# Altium project MPBoard_ext.PrjPcb
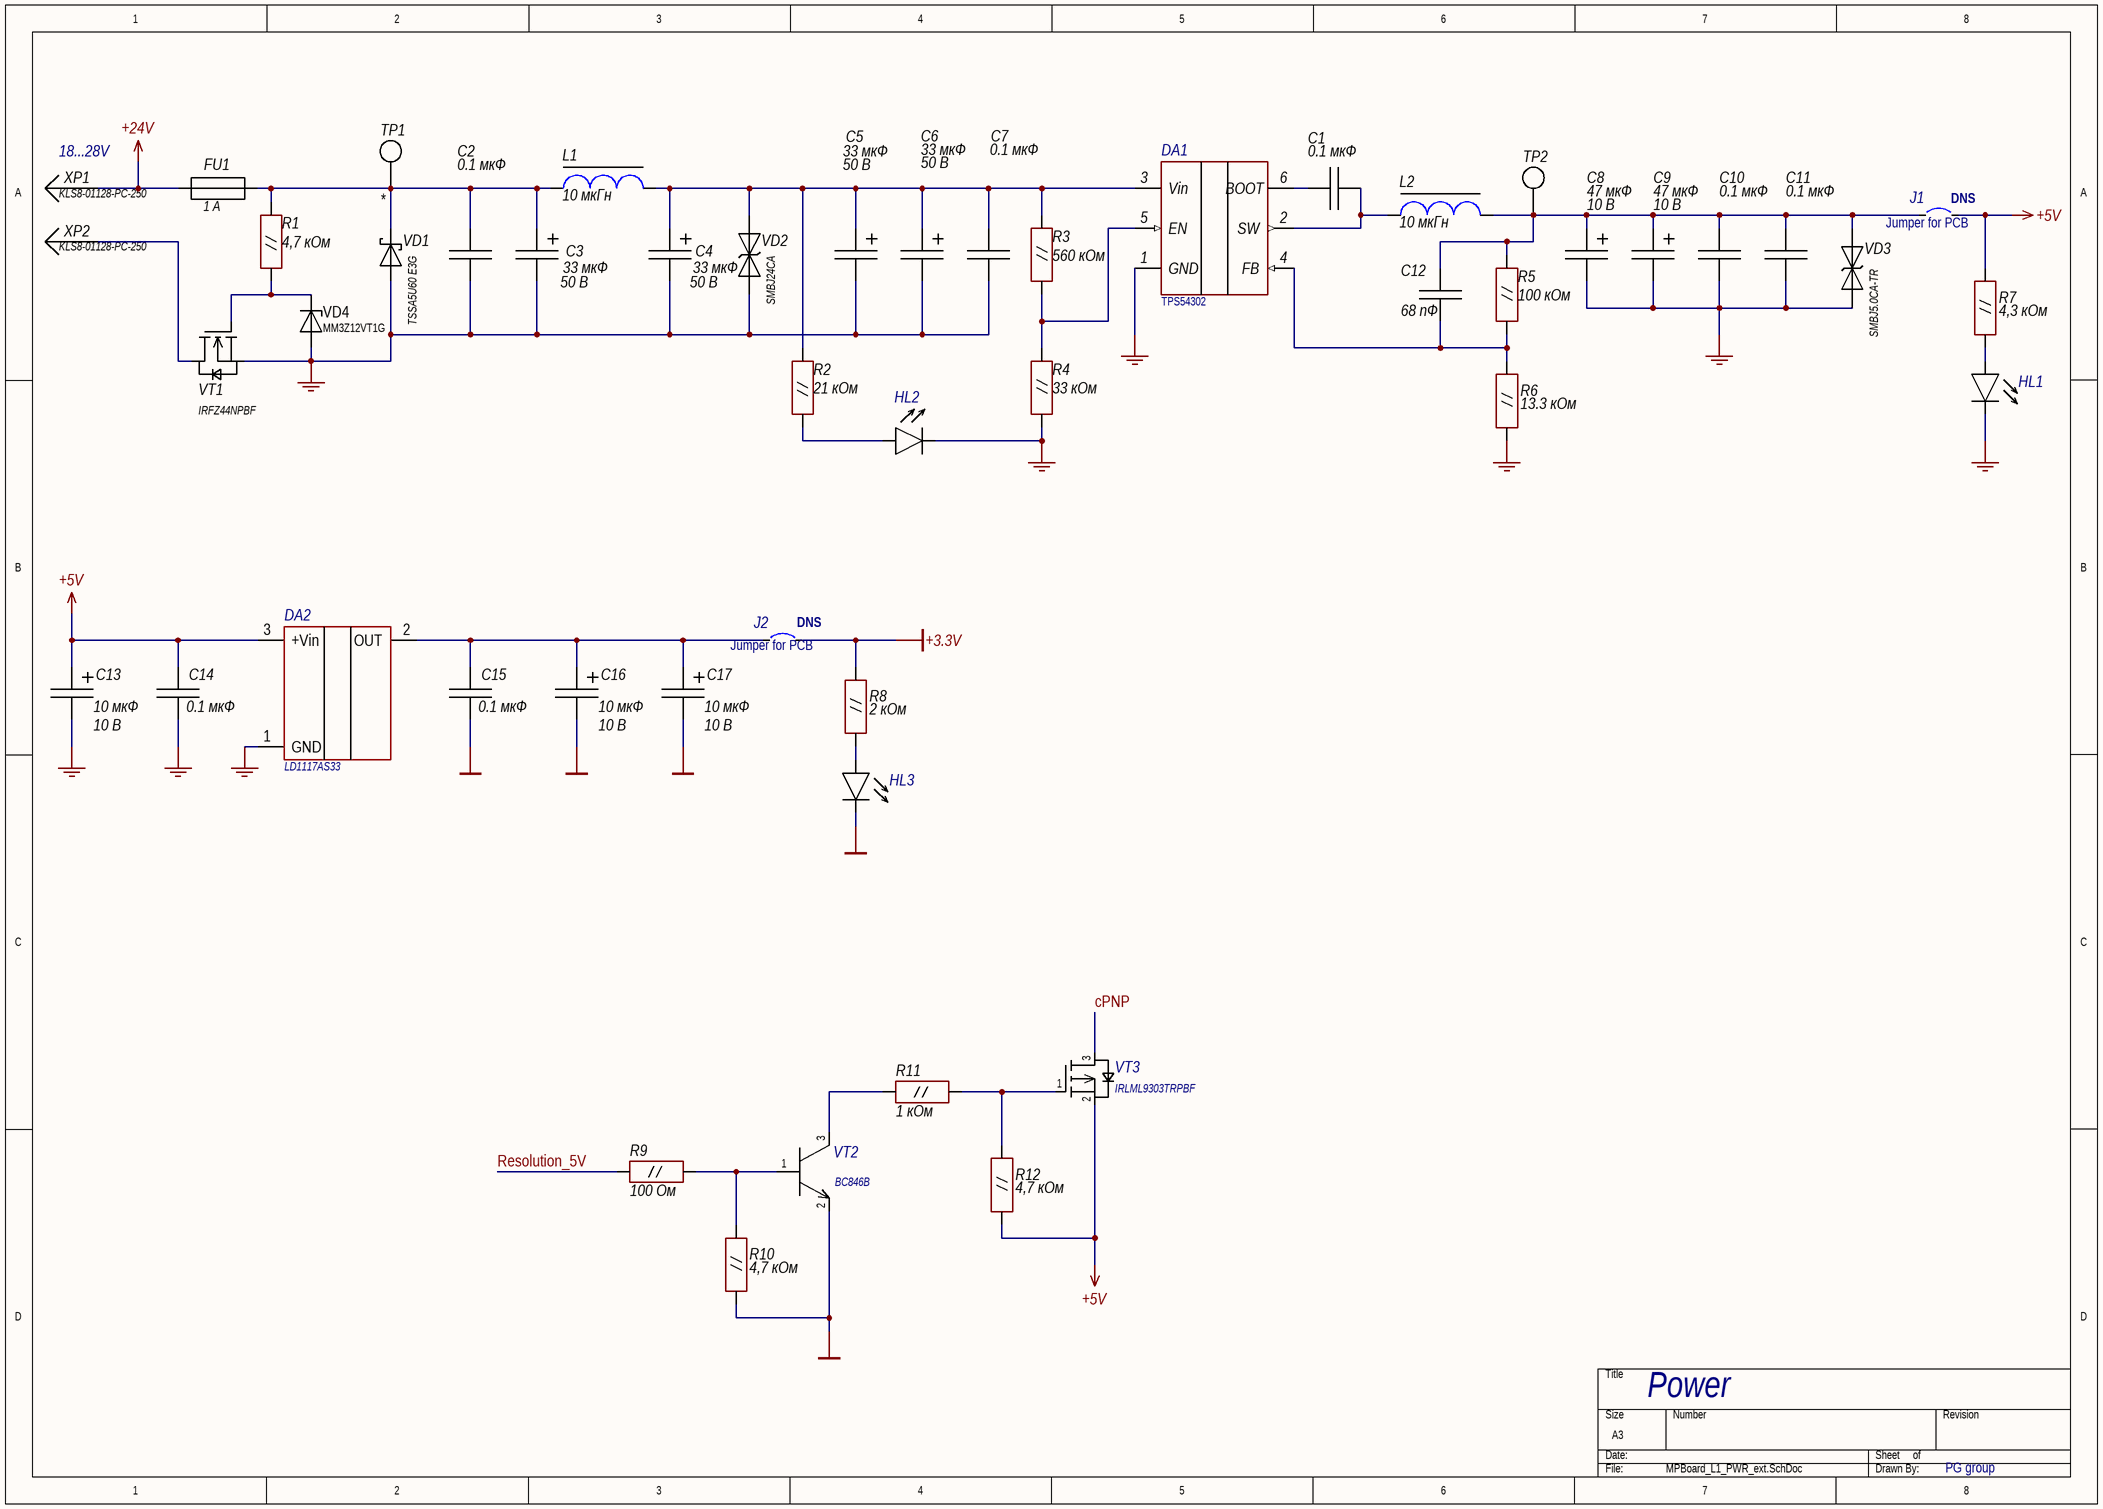
[diagram p0: MPBoard_L1_PWR_ext.SchDoc]
5 sheets, 340 parts. Net scope: global (net labels, ports and power ports of the same name join across sheets).
Board file: MPBoard_ext.PcbDoc
Sheets:
  MPBoard_L1_PWR_ext.SchDoc
  MPBoard_L2_Relay1_ext.SchDoc
  MPBoard_L3_Relay2_ext.SchDoc
  MPBoard_L4_Sens1_ext.SchDoc
  MPBoard_L5_Sens_2_ext.SchDoc

## Sheet MPBoard_L1_PWR_ext.SchDoc
size A3; SheetNumber: 1; SheetTotal: 5; SPICEModelCacheOIQWJWRF: <root> / <DocumentId>OIQWJWRF</DocumentId> / </root>

### Parts
C1  0.1 мкФ  [CAP-0805]
C2  0.1 мкФ  [CAP-0805]
C3  33 мкФ  Voltage: 50 В  [CAPAE-103]
C4  33 мкФ  Voltage: 50 В  [CAPAE-103]
C5  33 мкФ  Voltage: 50 В  [CAPAE-103]
C6  33 мкФ  Voltage: 50 В  [CAPAE-103]
C7  0.1 мкФ  [CAP-0805]
C8  47 мкФ  Voltage: 10 В  [CAPMP-3528]
C9  47 мкФ  Voltage: 10 В  [CAPMP-3528]
C10  0.1 мкФ  [CAP-0805]
C11  0.1 мкФ  [CAP-0805]
C12  68 пФ  [CAP-0805]
C13  10 мкФ  Voltage: 10 В  [CAPMP-3528]
C14  0.1 мкФ  [CAP-0805]
C15  0.1 мкФ  [CAP-0805]
C16  10 мкФ  Voltage: 10 В  [CAPMP-3528]
C17  10 мкФ  Voltage: 10 В  [CAPMP-3528]
DA1  TPS54302  [SOT23-6]
DA2  LD1117AS33  [SOT-223 LD1117]
FU1  1 A  [FUSE HOLDERS B 5X20]
HL1  Blue  [CH0805LB]  (value not drawn)
HL2  Red  [CH0805LR]  (value not drawn)
HL3  Green  [CH0805LG]  (value not drawn)
J1  Jumper for PCB  [JUMPER-SMD min]
J2  Jumper for PCB  [JUMPER-SMD min]
L1  10 мкГн  [IND_IHLP2525]
L2  10 мкГн  [IND_IHLP2525]
R1  4,7 кОм  [RES-0805]
R2  21 кОм  [RES-0805]
R3  560 кОм  [RES-0805]
R4  33 кОм  [RES-0805]
R5  100 кОм  [RES-0805]
R6  13.3 кОм  [RES-0805]
R7  4,3 кОм  [RES-0805]
R8  2 кОм  [RES-0805]
R9  100 Ом  [RES-0805]
R10  4,7 кОм  [RES-0805]
R11  1 кОм  [RES-0805]
R12  4,7 кОм  [RES-0805]
TP1  *  [TP_1.5]  (no BOM)
TP2  *  [TP_1.5]  (value not drawn)  (no BOM)
VD1  TSSA5U60 E3G  [DIODE SMA]
VD2  SMBJ24CA  [DIODE SMB]
VD3  SMBJ5.0CA-TR  [DIODE SMB]
VD4  MM3Z12VT1G  [SOD-323]
VT1  IRFZ44NPBF  [TO220S inline]
VT2  BC846B  [SOT23]
VT3  IRLML9303TRPBF  [SOT23]
XP1  KLS8-01128-PC-250  [PCB TAB 4]
XP2  KLS8-01128-PC-250  [PCB TAB 4]

### Nets
+3.3V: J2.2 R8.1
+5V: C13.1 C14.2 DA2.3(+Vin) J1.2 R7.1 R12.2 VT3.2(S)
+24V: FU1.1 XP1.1
GND: C2.2 C3.2 C4.2 C5.2 C6.2 C7.2 C8.2 C9.2 C10.2 C11.2 C13.2 C14.1 C15.1 C16.2 C17.2 DA1.1(GND) DA2.1(GND) HL1.2 HL2.2 HL3.2 R4.2 R6.2 R10.2 VD1.1 VD2.1 VD3.1 VD4.1 VT1.3(S) VT2.2(E)
cPNP: VT3.3(D)
Resolution_5V: R9.1
NetC1_1: C1.1 DA1.6(BOOT)
NetC1_2: C1.2 DA1.2(SW) L2.1
NetC2_1: C2.1 C3.1 FU1.2 L1.1 R1.2 TP1.1 VD1.2
NetC4_1: C4.1 C5.1 C6.1 C7.1 DA1.3(Vin) L1.2 R2.2 R3.1 VD2.2
NetC8_1: C8.1 C9.1 C10.1 C11.1 C12.1 J1.1 L2.2 R5.1 TP2.1 VD3.2
NetC12_2: C12.2 DA1.4(FB) R5.2 R6.1
NetC15_2: C15.2 C16.1 C17.1 DA2.2(OUT) J2.1
NetDA1_5: DA1.5(EN) R3.2 R4.1
NetHL1_1: HL1.1 R7.2
NetHL2_1: HL2.1 R2.1
NetHL3_1: HL3.1 R8.2
NetR1_1: R1.1 VD4.2 VT1.1(G)
NetR9_2: R9.2 R10.1 VT2.1(B)
NetR11_1: R11.1 VT2.3(C)
NetR11_2: R11.2 R12.1 VT3.1(G)
NetVT1_2: VT1.2(D) XP2.1

### Notes on the sheet
- (near XP1) 18...28V
- (near J1) DNS
- (near J2) DNS
- Power
- PG group

### Library data of the parts
C1 C2 C7 C10 = C: Конденсатор; MFPartNum: C0805C103K5RAC7025; IPSPartNumber: 65-724-19; Dielectric: X7R; MF: KEMET; Tolerance: ± 10 %; Voltage: 50 В; ValueDescription: Конденсатор 0.1 мкФ ± 10 % 50 В X7R SMD 0805; Package: SMD 0805; Value: 0.1 мкФ; HelpURL: https://content.kemet.com/datasheets/KEM_C1002_X7R_SMD.pdf; NameRUS: Конденсатор
C3 C4 = C_POLAR: Конденсатор полярный; MF: KEMET; Tolerance: ± 10 %; ValueDescription: Конденсатор 33 мкФ ± 10 % 50 В ECAP SMD; Package: ECAP SMD; Value: 33 мкФ; MFPartNum: *; HelpURL: *; IPSPartNumber: *; NameRUS: Конденсатор
C5 C6 = C_POLAR: Конденсатор полярный; IPSPartNumber: 2283588; MF: KEMET; Tolerance: ± 10 %; ValueDescription: Конденсатор 33 мкФ ± 10 % 50 В ECAP SMD; Package: ECAP SMD; Value: 33 мкФ; HelpURL: https://api.kemet.com/component-edge/download/datasheet/T491D336K035AT.pdf; NameRUS: Конденсатор
C8 C9 = C_POLAR: Конденсатор полярный / тантал; MFPartNum: T491B476K006AT; MF: KEMET; Tolerance: ± 10 %; ValueDescription: Конденсатор 47 мкФ ± 10 % 10 В Case B; Package: Case B; Value: 47 мкФ; HelpURL: https://content.kemet.com/datasheets/KEM_T2005_T491.pdf; IPSPartNumber: 300-47-868; NameRUS: Конденсатор
C11 = C: Конденсатор; MFPartNum: C0805C103K5RAC7025; IPSPartNumber: 65-765-65; Dielectric: X7R; MF: KEMET; Tolerance: ± 10 %; Voltage: 50 В; ValueDescription: Конденсатор 0.1 мкФ ± 10 % 50 В X7R SMD 0805; Package: SMD 0805; Value: 0.1 мкФ; HelpURL: https://content.kemet.com/datasheets/KEM_C1002_X7R_SMD.pdf; NameRUS: Конденсатор
C12 = C: Конденсатор; MFPartNum: C0805C680J5GACTU; Dielectric: C0G; MF: KEMET; Tolerance: ± 5 %; Voltage: 50 В; ValueDescription: Конденсатор 68 пФ ± 5 % 50 В C0G SMD 0805; Package: SMD 0805; Value: 68 пФ; IPSPartNumber: 165-72-398; NameRUS: Конденсатор
C13 C16 C17 = C_POLAR: Конденсатор полярный / тантал; MFPartNum: T491B476K006AT; MF: KEMET; Tolerance: ± 10 %; ValueDescription: Конденсатор 10 мкФ ± 10 % 10 В Case A; Package: Case A; Value: 10 мкФ; HelpURL: https://content.kemet.com/datasheets/KEM_T2005_T491.pdf; IPSPartNumber: 300-47-868; NameRUS: Конденсатор
C14 C15 = C: Конденсатор; MFPartNum: C0805C103K5RAC7025; MF: KEMET; Tolerance: ± 10 %; Voltage: 50 В; ValueDescription: Конденсатор 0.1 мкФ ± 10 % 50 В * SMD 0805; Dielectric: *; Package: SMD 0805; Value: 0.1 мкФ; HelpURL: *; IPSPartNumber: *; NameRUS: Конденсатор
DA1 = DA_TPS54302: DC/DC Buck; MFPartNum: TPS54302DDCR; MF: Texas Instruments; ValueDescription: Микросхема TPS54302 SOT23-6; NameRUS: Микросхема; Value: TPS54302; HelpURL: https://www.ti.com/lit/ds/symlink/tps54302.pdf?HQS=TI-null-null-digikeymode-df-pf-null-wwe&ts=1594294685289; Package: SOT23-6; IPSPartNumber: *
DA2 = DA_LD1117AS33: Linear Regulator 3.3V; MFPartNum: LD1117AS33TR; MF: STMicroelectronics; Package: SOT-223; HelpURL: https://eu.mouser.com/ProductDetail/STMicroelectronics/LD1117AS33TR?qs=C3bf%2FVrkE5CoDDd7wyn%252BaQ%3D%3D
FU1 = FU: Предохранитель; MFPartNum: RND 170-00190; Value: 1 A; MF: *; HelpURL: https://www.elfa.se/en/fuse-holder-clip-20-mm-3a-rnd-components-rnd-170-00190/p/30113404; IPSPartNumber: *; ValueDescription: =NameRUS+' '+Value+' '+ManufacturerPartNumber; NameRus: Предохранитель
HL1 = VD_LED: Светодиод; MFPartNum: FYLS-0805UBC; MF: Foryard; HelpURL: *; Value: Blue; Package: SMD 0805; IPSPartNumber: *; ValueDescription: =NameRUS+' '+ManufacturerPartNumber+' '+Package; NameRUS: Светодиод
HL2 = VD_LED: Светодиод; MFPartNum: FYLS-0805URC; MF: Foryard; HelpURL: *; Value: Red; Package: SMD 0805; IPSPartNumber: *; ValueDescription: =NameRUS+' '+ManufacturerPartNumber+' '+Package; NameRUS: Светодиод
HL3 = VD_LED: Светодиод; MFPartNum: FYLS-0805UGC; MF: Foryard; HelpURL: *; Value: Green; Package: SMD 0805; IPSPartNumber: *; ValueDescription: =NameRUS+' '+ManufacturerPartNumber+' '+Package; NameRUS: Светодиод
J1 J2 = Jumper: Перемычка на плату
L1 L2 = L_CORE: Индуктивность; MFPartNum: IHLP2525EZER100M01; MF: Vishay; AddDescription: 4.5А; Tolerance: ± 20 %; NameRUS: Дроссель; Value: 10 мкГн; HelpURL: https://www.vishay.com/docs/34177/ihlp-2525ez-01.pdf; IPSPartNumber: *; ValueDescription: =NameRUS+' '+Value+' '+Tolerance+' '+AddDescription+' '+Package
R1 R10 R12 = R_0.125W: Резистор 0.125 W; MFPartNum: CRCW080513K3FKEA; MF: Vishay; Tolerance: ± 1 %; ValueDescription: Резистор 4,7 кОм ± 1 % SMD 0805; Package: SMD 0805; Value: 4,7 кОм; HelpURL: https://www.vishay.com/docs/20035/dcrcwe3.pdf; IPSPartNumber: *; NameRUS: Резистор
R2 = R_0.125W: Резистор 0.125 W; MFPartNum: CRCW080513K3FKEA; MF: Vishay; Tolerance: ± 1 %; ValueDescription: Резистор 21 кОм ± 1 % SMD 0805; Package: SMD 0805; Value: 21 кОм; HelpURL: https://www.vishay.com/docs/20035/dcrcwe3.pdf; IPSPartNumber: *; NameRUS: Резистор
R3 = R_0.125W: Резистор 0.125 W; MFPartNum: CRCW080513K3FKEA; MF: Vishay; Tolerance: ± 5 %; ValueDescription: Резистор 560 кОм ± 5 % SMD 0805; Package: SMD 0805; Value: 560 кОм; HelpURL: https://www.vishay.com/docs/20035/dcrcwe3.pdf; IPSPartNumber: *; NameRUS: Резистор
R4 = R_0.125W: Резистор 0.125 W; MFPartNum: CRCW080513K3FKEA; MF: Vishay; Tolerance: ± 5 %; ValueDescription: Резистор 33 кОм ± 5 % SMD 0805; Package: SMD 0805; Value: 33 кОм; HelpURL: https://www.vishay.com/docs/20035/dcrcwe3.pdf; IPSPartNumber: *; NameRUS: Резистор
R5 = R_0.125W: Резистор 0.125 W; MFPartNum: CRCW080513K3FKEA; MF: Vishay; Tolerance: ± 5 %; ValueDescription: Резистор 100 кОм ± 5 % SMD 0805; Package: SMD 0805; Value: 100 кОм; HelpURL: https://www.vishay.com/docs/20035/dcrcwe3.pdf; IPSPartNumber: *; NameRUS: Резистор
R6 = R_0.125W: Резистор 0.125 W; MFPartNum: CRCW080513K3FKEA; MF: Vishay; Tolerance: ± 1 %; ValueDescription: Резистор 13.3 кОм ± 1 % SMD 0805; Package: SMD 0805; Value: 13.3 кОм; HelpURL: https://www.vishay.com/docs/20035/dcrcwe3.pdf; IPSPartNumber: *; NameRUS: Резистор
R7 = R_0.125W: Резистор 0.125 W; MFPartNum: CRCW080513K3FKEA; MF: Vishay; Tolerance: ± 1 %; ValueDescription: Резистор 4,3 кОм ± 1 % SMD 0805; Package: SMD 0805; Value: 4,3 кОм; HelpURL: https://www.vishay.com/docs/20035/dcrcwe3.pdf; IPSPartNumber: *; NameRUS: Резистор
R8 = R_0.125W: Резистор 0.125 W; MFPartNum: CRCW080513K3FKEA; MF: Vishay; Tolerance: ± 1 %; ValueDescription: Резистор 2 кОм ± 1 % SMD 0805; Package: SMD 0805; Value: 2 кОм; HelpURL: https://www.vishay.com/docs/20035/dcrcwe3.pdf; IPSPartNumber: *; NameRUS: Резистор
R9 = R_0.125W: Резистор 0.125 W; MFPartNum: CRCW080513K3FKEA; MF: Vishay; Tolerance: ± 1 %; ValueDescription: Резистор 100 Ом ± 1 % SMD 0805; Package: SMD 0805; Value: 100 Ом; HelpURL: https://www.vishay.com/docs/20035/dcrcwe3.pdf; IPSPartNumber: *; NameRUS: Резистор
R11 = R_0.125W: Резистор 0.125 W; MFPartNum: CRCW080513K3FKEA; MF: Vishay; Tolerance: ± 1 %; ValueDescription: Резистор 1 кОм ± 1 % SMD 0805; Package: SMD 0805; Value: 1 кОм; HelpURL: https://www.vishay.com/docs/20035/dcrcwe3.pdf; IPSPartNumber: *; NameRUS: Резистор
TP1 TP2 = TEST_POINT: Test Point; Name: *
VD1 = VD_SHOTTKY: Диод Шоттки; MF: Taiwan Semiconductor; Analogue: SS56; ValueDescription: Диод Шоттки TSSA5U60 E3G DO-214AC (SMA); MFPartNum: TSSA5U60 E3G; HelpURL: https://ru.mouser.com/datasheet/2/395/TSSA5U50%20SERIES_D1512-911402.pdf; Value: TSSA5U60 E3G; Package: DO-214AC (SMA); NameRUS: Диод Шоттки
VD2 = VD_TVS_BIDIR: Супрессор; MF: STMicroelectronics; ValueDescription: Супрессор SMBJ24CA DO-214AA (SMB); MFPartNum: SMBJ24CA; HelpURL: https://www.chipdip.by/product/smbj24ca-sunmate; Value: SMBJ24CA; Package: DO-214AA (SMB); IPSPartNumber: *; NameRUS: Супрессор
VD3 = VD_TVS_BIDIR: Супрессор; MF: STMicroelectronics; ValueDescription: Супрессор SMBJ5.0CA-TR DO-214AA (SMB); MFPartNum: SMBJ5.0CA-TR; HelpURL: https://www.chipdip.ru/product0/8001777571; Value: SMBJ5.0CA-TR; Package: DO-214AA (SMB); IPSPartNumber: 300-34-034; NameRUS: Супрессор
VD4 = VD_ZENER: Стабилитрон; MF: Nexperia; Analogue: BZX384-C12,115; ValueDescription: Стабилитрон MM3Z12VT1G SOD323; MFPartNum: MM3Z12VT1G; HelpURL: https://eu.mouser.com/datasheet/2/916/MM3Z_SER-2487701.pdf; Value: MM3Z12VT1G; Package: SOD323; NameRUS: Стабилитрон
VT1 = VT_N-MOSFET: MOSFET; MF: Infineon Technologies; NameRUS: N-канальный полевой транзистор; HelpURL: *; Value: IRFZ44N; IPSPartNumber: *; MFPartNum: IRFZ44NPBF; ValueDescription: =NameRUS+' '+ManufacturerPartNumber+' '+Voltage+' '+Current+' '+Package; Voltage: *; Current: *; Package: TO-220AB
VT2 = VT_NPN: NPN транзистор; MFPartNum: BC846B,215; MF: Nexperia B.V.; NameRUS: NPN биполярный транзистор; Voltage: 65 В; Current: 0.1; HelpURL: https://www.chipdip.by/product/bc846b; Value: BC846B; IPSPartNumber: *; ValueDescription: =NameRUS+' '+ManufacturerPartNumber+' '+Voltage+' '+Current+' '+Package; Package: SOT-23
VT3 = VT_P-MOSFET: P-MOSFET; MF: INFINEON TECHNOLOGIES AG.; Voltage: 30 В; Current: 2.3; MFPartNum: IRLML9303TRPBF; Package: SOT-23; HelpURL: https://www.chipdip.by/product/irlml9303trpbf
XP1 XP2 = XP1: Клемма папа; MF: KLS; MFPartNum: KLS8-01128-PC-250; HelpURL: https://www.chipdip.by/product/ta-m; Value: KLS8-01128-PC-250; Package: *

## Sheet MPBoard_L2_Relay1_ext.SchDoc
size A3; SheetNumber: 2; SheetTotal: 5
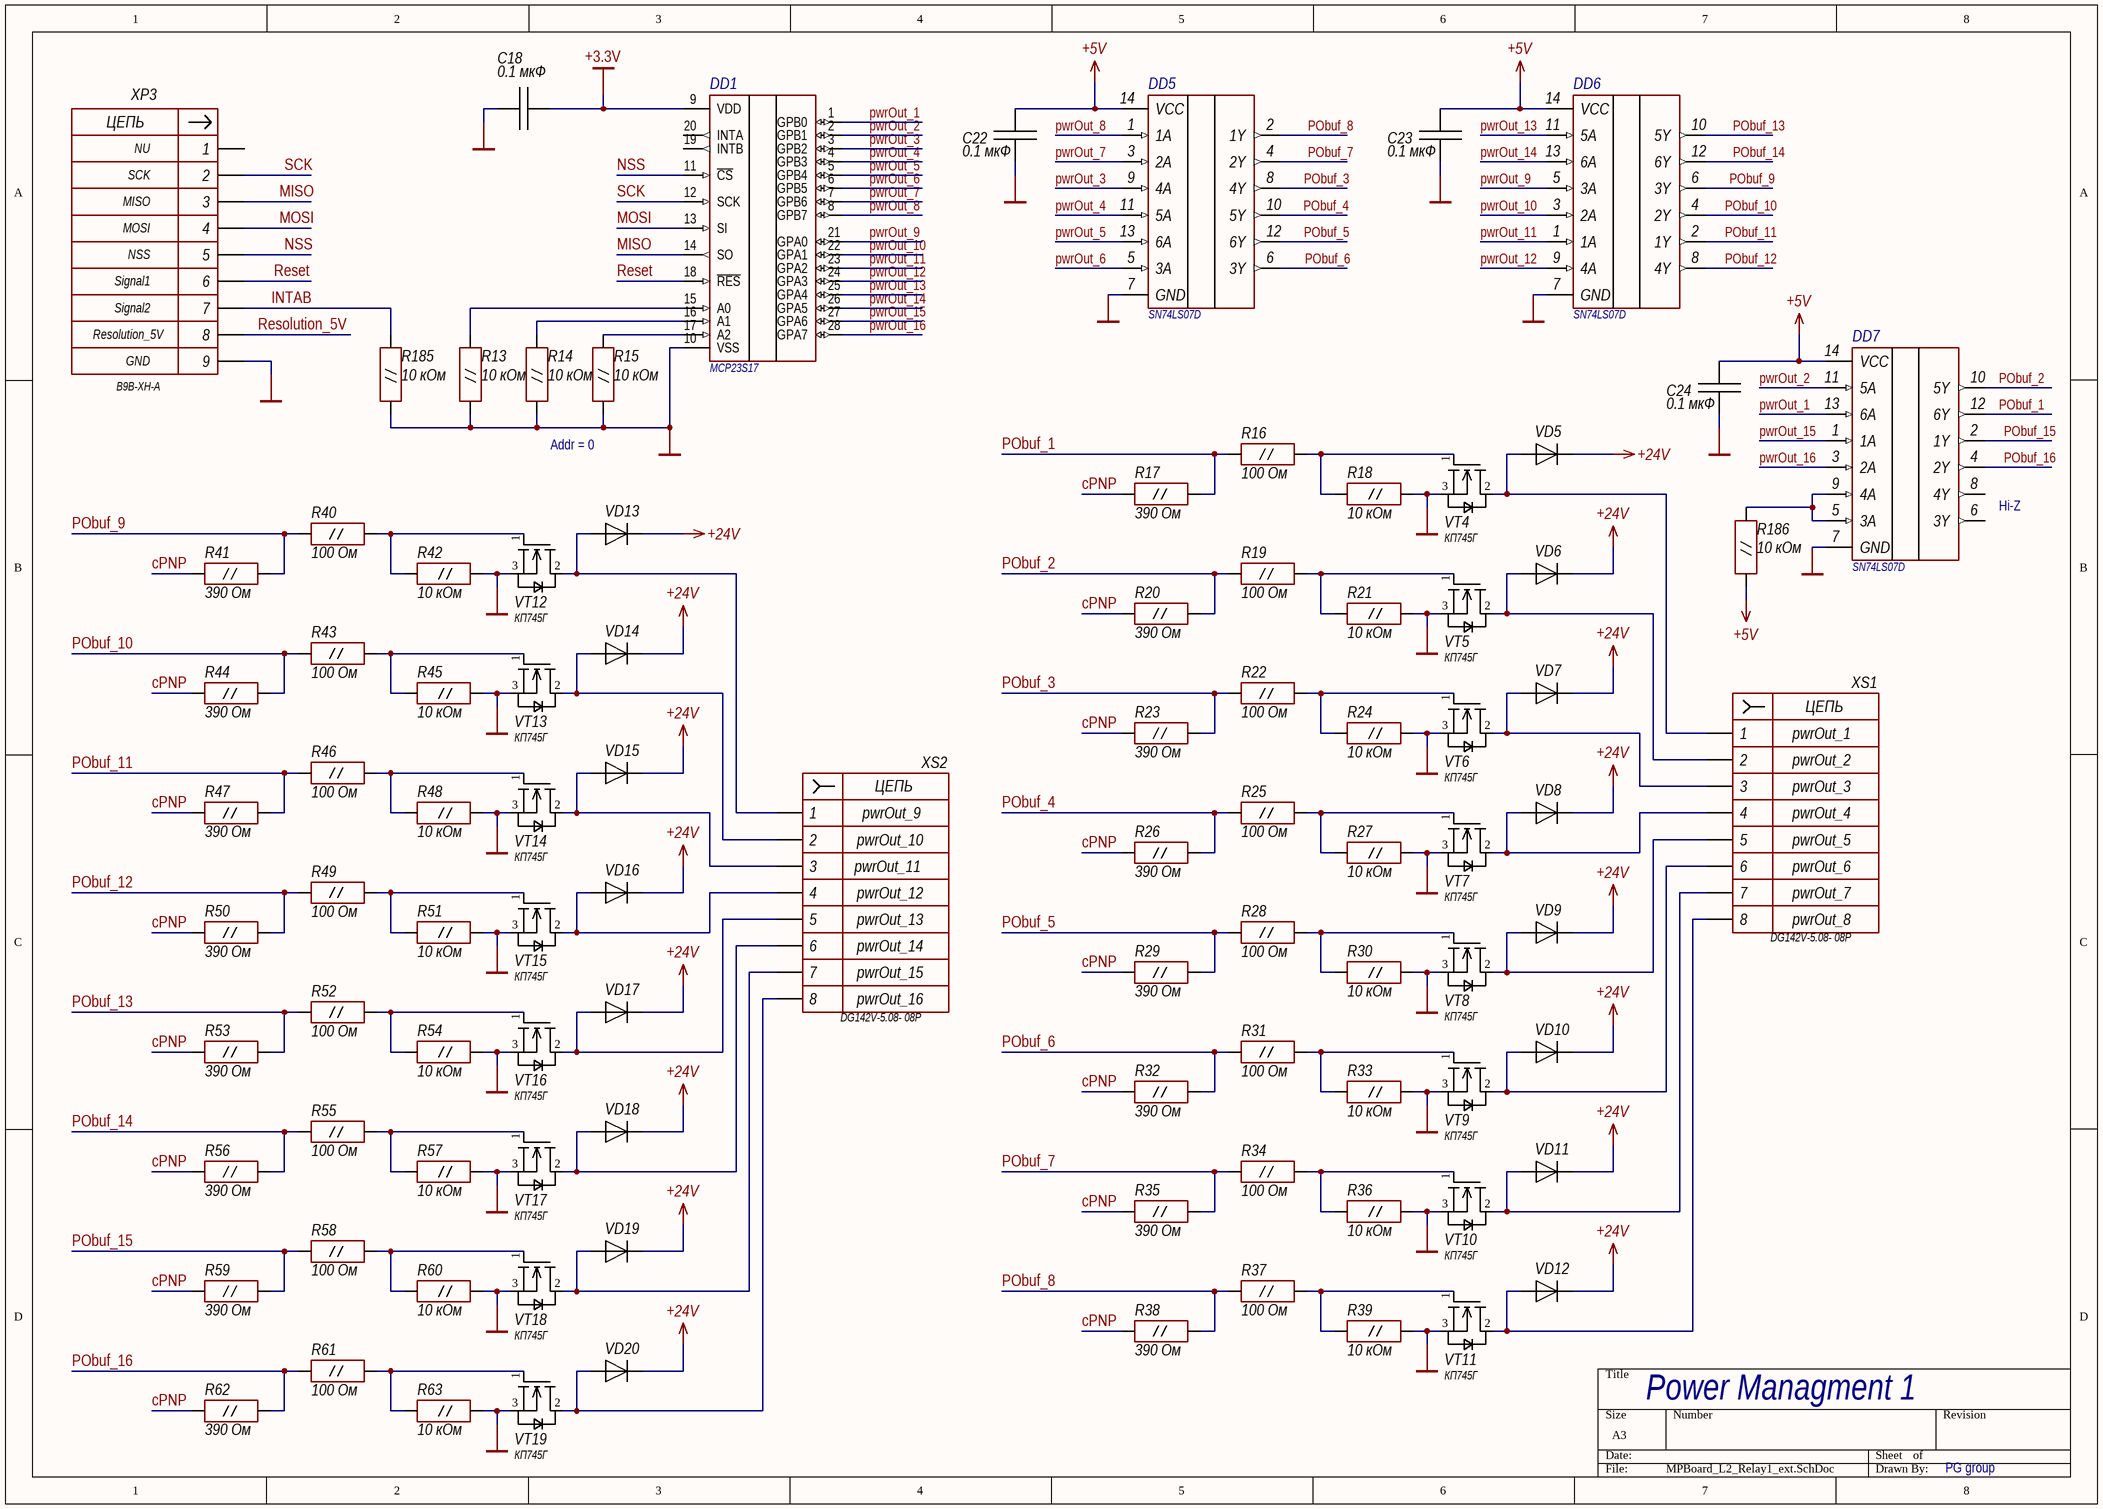
[diagram p1: MPBoard_L2_Relay1_ext.SchDoc]

### Parts
C18  0.1 мкФ  [CAP-0603]
C22  0.1 мкФ  [CAP-0603]
C23  0.1 мкФ  [CAP-0603]
C24  0.1 мкФ  [CAP-0603]
DD1  MCP23S17  [SOIC-28]
DD5  SN74LS07D  [SOIC-14]
DD6  SN74LS07D  [SOIC-14]
DD7  SN74LS07D  [SOIC-14]
R13  10 кОм  [RES-0603]
R14  10 кОм  [RES-0603]
R15  10 кОм  [RES-0603]
R16  100 Ом  [RES-0805]
R17  390 Ом  [RES-0805]
R18  10 кОм  [RES-0805]
R19  100 Ом  [RES-0805]
R20  390 Ом  [RES-0805]
R21  10 кОм  [RES-0805]
R22  100 Ом  [RES-0805]
R23  390 Ом  [RES-0805]
R24  10 кОм  [RES-0805]
R25  100 Ом  [RES-0805]
R26  390 Ом  [RES-0805]
R27  10 кОм  [RES-0805]
R28  100 Ом  [RES-0805]
R29  390 Ом  [RES-0805]
R30  10 кОм  [RES-0805]
R31  100 Ом  [RES-0805]
R32  390 Ом  [RES-0805]
R33  10 кОм  [RES-0805]
R34  100 Ом  [RES-0805]
R35  390 Ом  [RES-0805]
R36  10 кОм  [RES-0805]
R37  100 Ом  [RES-0805]
R38  390 Ом  [RES-0805]
R39  10 кОм  [RES-0805]
R40  100 Ом  [RES-0805]
R41  390 Ом  [RES-0805]
R42  10 кОм  [RES-0805]
R43  100 Ом  [RES-0805]
R44  390 Ом  [RES-0805]
R45  10 кОм  [RES-0805]
R46  100 Ом  [RES-0805]
R47  390 Ом  [RES-0805]
R48  10 кОм  [RES-0805]
R49  100 Ом  [RES-0805]
R50  390 Ом  [RES-0805]
R51  10 кОм  [RES-0805]
R52  100 Ом  [RES-0805]
R53  390 Ом  [RES-0805]
R54  10 кОм  [RES-0805]
R55  100 Ом  [RES-0805]
R56  390 Ом  [RES-0805]
R57  10 кОм  [RES-0805]
R58  100 Ом  [RES-0805]
R59  390 Ом  [RES-0805]
R60  10 кОм  [RES-0805]
R61  100 Ом  [RES-0805]
R62  390 Ом  [RES-0805]
R63  10 кОм  [RES-0805]
R185  10 кОм  [RES-0603]
R186  10 кОм  [RES-0603]
VD5  HER108  [DIOD-MILS-400]  (value not drawn)
VD6  HER108  [DIOD-MILS-400]  (value not drawn)
VD7  HER108  [DIOD-MILS-400]  (value not drawn)
VD8  HER108  [DIOD-MILS-400]  (value not drawn)
VD9  HER108  [DIOD-MILS-400]  (value not drawn)
VD10  HER108  [DIOD-MILS-400]  (value not drawn)
VD11  HER108  [DIOD-MILS-400]  (value not drawn)
VD12  HER108  [DIOD-MILS-400]  (value not drawn)
VD13  HER108  [DIOD-MILS-400]  (value not drawn)
VD14  HER108  [DIOD-MILS-400]  (value not drawn)
VD15  HER108  [DIOD-MILS-400]  (value not drawn)
VD16  HER108  [DIOD-MILS-400]  (value not drawn)
VD17  HER108  [DIOD-MILS-400]  (value not drawn)
VD18  HER108  [DIOD-MILS-400]  (value not drawn)
VD19  HER108  [DIOD-MILS-400]  (value not drawn)
VD20  HER108  [DIOD-MILS-400]  (value not drawn)
VT4  КП745Г  [TO220S inline]
VT5  КП745Г  [TO220S inline]
VT6  КП745Г  [TO220S inline]
VT7  КП745Г  [TO220S inline]
VT8  КП745Г  [TO220S inline]
VT9  КП745Г  [TO220S inline]
VT10  КП745Г  [TO220S inline]
VT11  КП745Г  [TO220S inline]
VT12  КП745Г  [TO220S inline]
VT13  КП745Г  [TO220S inline]
VT14  КП745Г  [TO220S inline]
VT15  КП745Г  [TO220S inline]
VT16  КП745Г  [TO220S inline]
VT17  КП745Г  [TO220S inline]
VT18  КП745Г  [TO220S inline]
VT19  КП745Г  [TO220S inline]
XP3  B9B-XH-A  NET9: GND  NET8: Resolution_5V  NET7: Signal2  NET6: Signal1  NET5: MOSI  NET1: NU  NET2: NSS  NET3: SCK  NET4: MISO  [JST-B9B-XH-A]
XS1  DG142V-5.08- 08P  NET6: pwrOut_6  NET5: pwrOut_5  NET1: pwrOut_1  NET2: pwrOut_2  NET3: pwrOut_3  NET4: pwrOut_4  NET7: pwrOut_7  NET8: pwrOut_8  [DG142V-5.08-08]
XS2  DG142V-5.08- 08P  NET6: pwrOut_14  NET5: pwrOut_13  NET1: pwrOut_9  NET2: pwrOut_10  NET3: pwrOut_11  NET4: pwrOut_12  NET7: pwrOut_15  NET8: pwrOut_16  [DG142V-5.08-08]

### Nets
+3.3V: C18.2 DD1.9(VDD)
+5V: C22.2 C23.2 C24.2 DD5.14(VCC) DD6.14(VCC) DD7.14(VCC) R186.1
+24V: VD5.2 VD6.2 VD7.2 VD8.2 VD9.2 VD10.2 VD11.2 VD12.2 VD13.2 VD14.2 VD15.2 VD16.2 VD17.2 VD18.2 VD19.2 VD20.2
GND: C18.1 C22.1 C23.1 C24.1 DD1.10(VSS) DD5.7(GND) DD6.7(GND) DD7.7(GND) R13.1 R14.1 R15.1 R18.1 R21.1 R24.1 R27.1 R30.1 R33.1 R36.1 R39.1 R42.1 R45.1 R48.1 R51.1 R54.1 R57.1 R60.1 R63.1 R185.1 VT4.3(S) VT5.3(S) VT6.3(S) VT7.3(S) VT8.3(S) VT9.3(S) VT10.3(S) VT11.3(S) VT12.3(S) VT13.3(S) VT14.3(S) VT15.3(S) VT16.3(S) VT17.3(S) VT18.3(S) VT19.3(S) XP3.9
cPNP: R17.1 R20.1 R23.1 R26.1 R29.1 R32.1 R35.1 R38.1 R41.1 R44.1 R47.1 R50.1 R53.1 R56.1 R59.1 R62.1
INTAB: R185.2 XP3.7
MISO: DD1.14(SO) XP3.3
MOSI: DD1.13(SI) XP3.4
NSS: DD1.11(~{CS}) XP3.5
PObuf_1: DD7.12(6Y) R16.1 R17.2
PObuf_2: DD7.10(5Y) R19.1 R20.2
PObuf_3: DD5.8(4Y) R22.1 R23.2
PObuf_4: DD5.10(5Y) R25.1 R26.2
PObuf_5: DD5.12(6Y) R28.1 R29.2
PObuf_6: DD5.6(3Y) R31.1 R32.2
PObuf_7: DD5.4(2Y) R34.1 R35.2
PObuf_8: DD5.2(1Y) R37.1 R38.2
PObuf_9: DD6.6(3Y) R40.1 R41.2
PObuf_10: DD6.4(2Y) R43.1 R44.2
PObuf_11: DD6.2(1Y) R46.1 R47.2
PObuf_12: DD6.8(4Y) R49.1 R50.2
PObuf_13: DD6.10(5Y) R52.1 R53.2
PObuf_14: DD6.12(6Y) R55.1 R56.2
PObuf_15: DD7.2(1Y) R58.1 R59.2
PObuf_16: DD7.4(2Y) R61.1 R62.2
pwrOut_1: DD1.1(GPB0) DD7.13(6A)
pwrOut_2: DD1.2(GPB1) DD7.11(5A)
pwrOut_3: DD1.3(GPB2) DD5.9(4A)
pwrOut_4: DD1.4(GPB3) DD5.11(5A)
pwrOut_5: DD1.5(GPB4) DD5.13(6A)
pwrOut_6: DD1.6(GPB5) DD5.5(3A)
pwrOut_7: DD1.7(GPB6) DD5.3(2A)
pwrOut_8: DD1.8(GPB7) DD5.1(1A)
pwrOut_9: DD1.21(GPA0) DD6.5(3A)
pwrOut_10: DD1.22(GPA1) DD6.3(2A)
pwrOut_11: DD1.23(GPA2) DD6.1(1A)
pwrOut_12: DD1.24(GPA3) DD6.9(4A)
pwrOut_13: DD1.25(GPA4) DD6.11(5A)
pwrOut_14: DD1.26(GPA5) DD6.13(6A)
pwrOut_15: DD1.27(GPA6) DD7.1(1A)
pwrOut_16: DD1.28(GPA7) DD7.3(2A)
Reset: DD1.18(~{RES}) XP3.6
Resolution_5V: XP3.8
SCK: DD1.12(SCK) XP3.2
NetDD1_15: DD1.15(A0) R13.2
NetDD1_16: DD1.16(A1) R14.2
NetDD1_17: DD1.17(A2) R15.2
NetDD7_5: DD7.5(3A) DD7.9(4A) R186.2
NetR16_2: R16.2 R18.2 VT4.1(G)
NetR19_2: R19.2 R21.2 VT5.1(G)
NetR22_2: R22.2 R24.2 VT6.1(G)
NetR25_2: R25.2 R27.2 VT7.1(G)
NetR28_2: R28.2 R30.2 VT8.1(G)
NetR31_2: R31.2 R33.2 VT9.1(G)
NetR34_2: R34.2 R36.2 VT10.1(G)
NetR37_2: R37.2 R39.2 VT11.1(G)
NetR40_2: R40.2 R42.2 VT12.1(G)
NetR43_2: R43.2 R45.2 VT13.1(G)
NetR46_2: R46.2 R48.2 VT14.1(G)
NetR49_2: R49.2 R51.2 VT15.1(G)
NetR52_2: R52.2 R54.2 VT16.1(G)
NetR55_2: R55.2 R57.2 VT17.1(G)
NetR58_2: R58.2 R60.2 VT18.1(G)
NetR61_2: R61.2 R63.2 VT19.1(G)
NetVD5_1: VD5.1 VT4.2(D) XS1.1
NetVD6_1: VD6.1 VT5.2(D) XS1.2
NetVD7_1: VD7.1 VT6.2(D) XS1.3
NetVD8_1: VD8.1 VT7.2(D) XS1.4
NetVD9_1: VD9.1 VT8.2(D) XS1.5
NetVD10_1: VD10.1 VT9.2(D) XS1.6
NetVD11_1: VD11.1 VT10.2(D) XS1.7
NetVD12_1: VD12.1 VT11.2(D) XS1.8
NetVD13_1: VD13.1 VT12.2(D) XS2.1
NetVD14_1: VD14.1 VT13.2(D) XS2.2
NetVD15_1: VD15.1 VT14.2(D) XS2.3
NetVD16_1: VD16.1 VT15.2(D) XS2.4
NetVD17_1: VD17.1 VT16.2(D) XS2.5
NetVD18_1: VD18.1 VT17.2(D) XS2.6
NetVD19_1: VD19.1 VT18.2(D) XS2.7
NetVD20_1: VD20.1 VT19.2(D) XS2.8

Not connected (* = marked no-connect by the designer): DD1 19(INTB) 20(INTA); DD7 6(3Y) 8(4Y); XP3 1

### Notes on the sheet
- Addr = 0
- (near DD7) Hi-Z
- Power Managment 1
- PG group
- (in symbol XP9) ЦЕПЬ
- (in symbol XS8) ЦЕПЬ

### Library data of the parts
C18 C22-C24 = C: Конденсатор; MFPartNum: C0603C101K5GAC; IPSPartNumber: 65-724-19; Dielectric: X7R; MF: KEMET; Tolerance: ± 10 %; Voltage: 50 В; ValueDescription: Конденсатор 0.1 мкФ ± 10 % 50 В X7R SMD 0603; Package: SMD 0603; Value: 0.1 мкФ; HelpURL: https://content.kemet.com/datasheets/KEM_C1002_X7R_SMD.pdf; NameRUS: Конденсатор
DD1 = DD_MCP23S17: I/O Expander 16 SPI; MF: Microchip; MFPartNum: MCP23S17; Package: SOIC-28; HelpURL: https://www.chipdip.ru/product/mcp23s17-e-so
DD5-DD7 = DD_SN74LS07D: 6-ch, 4.75_5.25V bipolar buffers with OC outputs; MF: Texas Instruments; MFPartNum: SN74LS07D; Package: SOIC-14; HelpURL: https://www.chipdip.by/product/sn74ls07d
R13-R15 R185 R186 = R_0.125W: Резистор 0.1 W; MFPartNum: D11/CRCW0603; MF: Vishay; Tolerance: ± 1 %; ValueDescription: Резистор 10 кОм ± 1 % SMD 0603; Package: SMD 0603; Value: 10 кОм; HelpURL: https://www.vishay.com/docs/20035/dcrcwe3.pdf; IPSPartNumber: *; NameRUS: Резистор
R16 R19 R22 R25 R28 R31 R34 R37 R40 R43 R46 R49 R52 R55 R58 R61 = R_0.125W: as R9 on sheet MPBoard_L1_PWR_ext; Package: SMD 0805; Value: 100 Ом; HelpURL: https://www.vishay.com/docs/20035/dcrcwe3.pdf; IPSPartNumber: *; NameRUS: Резистор
R17 R20 R23 R26 R29 R32 R35 R38 R41 R44 R47 R50 R53 R56 R59 R62 = R_0.125W: Резистор 0.125 W; MFPartNum: CRCW080513K3FKEA; MF: Vishay; Tolerance: ± 1 %; ValueDescription: Резистор 390 Ом ± 1 % SMD 0805; Package: SMD 0805; Value: 390 Ом; HelpURL: https://www.vishay.com/docs/20035/dcrcwe3.pdf; IPSPartNumber: *; NameRUS: Резистор
R18 R21 R24 R27 R30 R33 R36 R39 R42 R45 R48 R51 R54 R57 R60 R63 = R_0.125W: Резистор 0.125 W; MFPartNum: CRCW080513K3FKEA; MF: Vishay; Tolerance: ± 1 %; ValueDescription: Резистор 10 кОм ± 1 % SMD 0805; Package: SMD 0805; Value: 10 кОм; HelpURL: https://www.vishay.com/docs/20035/dcrcwe3.pdf; IPSPartNumber: *; NameRUS: Резистор
VD5-VD20 = VD: Диод Выпрямительный; MFPartNum: HER108G; MF: Taiwan Semiconductor; ValueDescription: Диод выпрямительный HER108 DO-204AL-2; HelpURL: https://eu.mouser.com/ProductDetail/?qs=tHU%2FlV7kTySN6KO41tibrA%3D%3D; Value: HER108; Package: DO-204AL-2; NameRUS: Диод выпрямительный
VT4-VT19 = VT_N-MOSFET: MOSFET; MF: Интеграл; Voltage: 100 В; Current: 15 А; Analogue: IRL530N; MFPartNum: КП745Г; Package: TO-220; HelpURL: https://belchip.by/product/?selected_product=10167
XP3 = XP9: вилка 9 контактов; MF: JST Corporation; Analogue: CWF-9; WK-09; DS1069-9MVW6; CWF-9 W7600-09PSNTW0R; ValueDescription: Разъем вилка B9B-XH-A; NameRUS: Разъем вилка; MFPartNum: B9B-XH-A; HelpURL: https://www.chipdip.ru/product0/8007237297?from=suggest_product; Value: B9B-XH-A
XS1 XS2 = XS8: розетка 8 контактов; MFPartNum: DG142V-5.08- 08P-14-00A(H); MF: Degson Electronics; ValueDescription: Разъем розетка DG142V-5.08- 08P; NameRUS: Разъем розетка; Value: DG142V-5.08- 08P; HelpURL: https://www.chipdip.by/product0/8077186472; IPSPartNumber: *

## Sheet MPBoard_L3_Relay2_ext.SchDoc
size A3; SheetNumber: 3; SheetTotal: 5
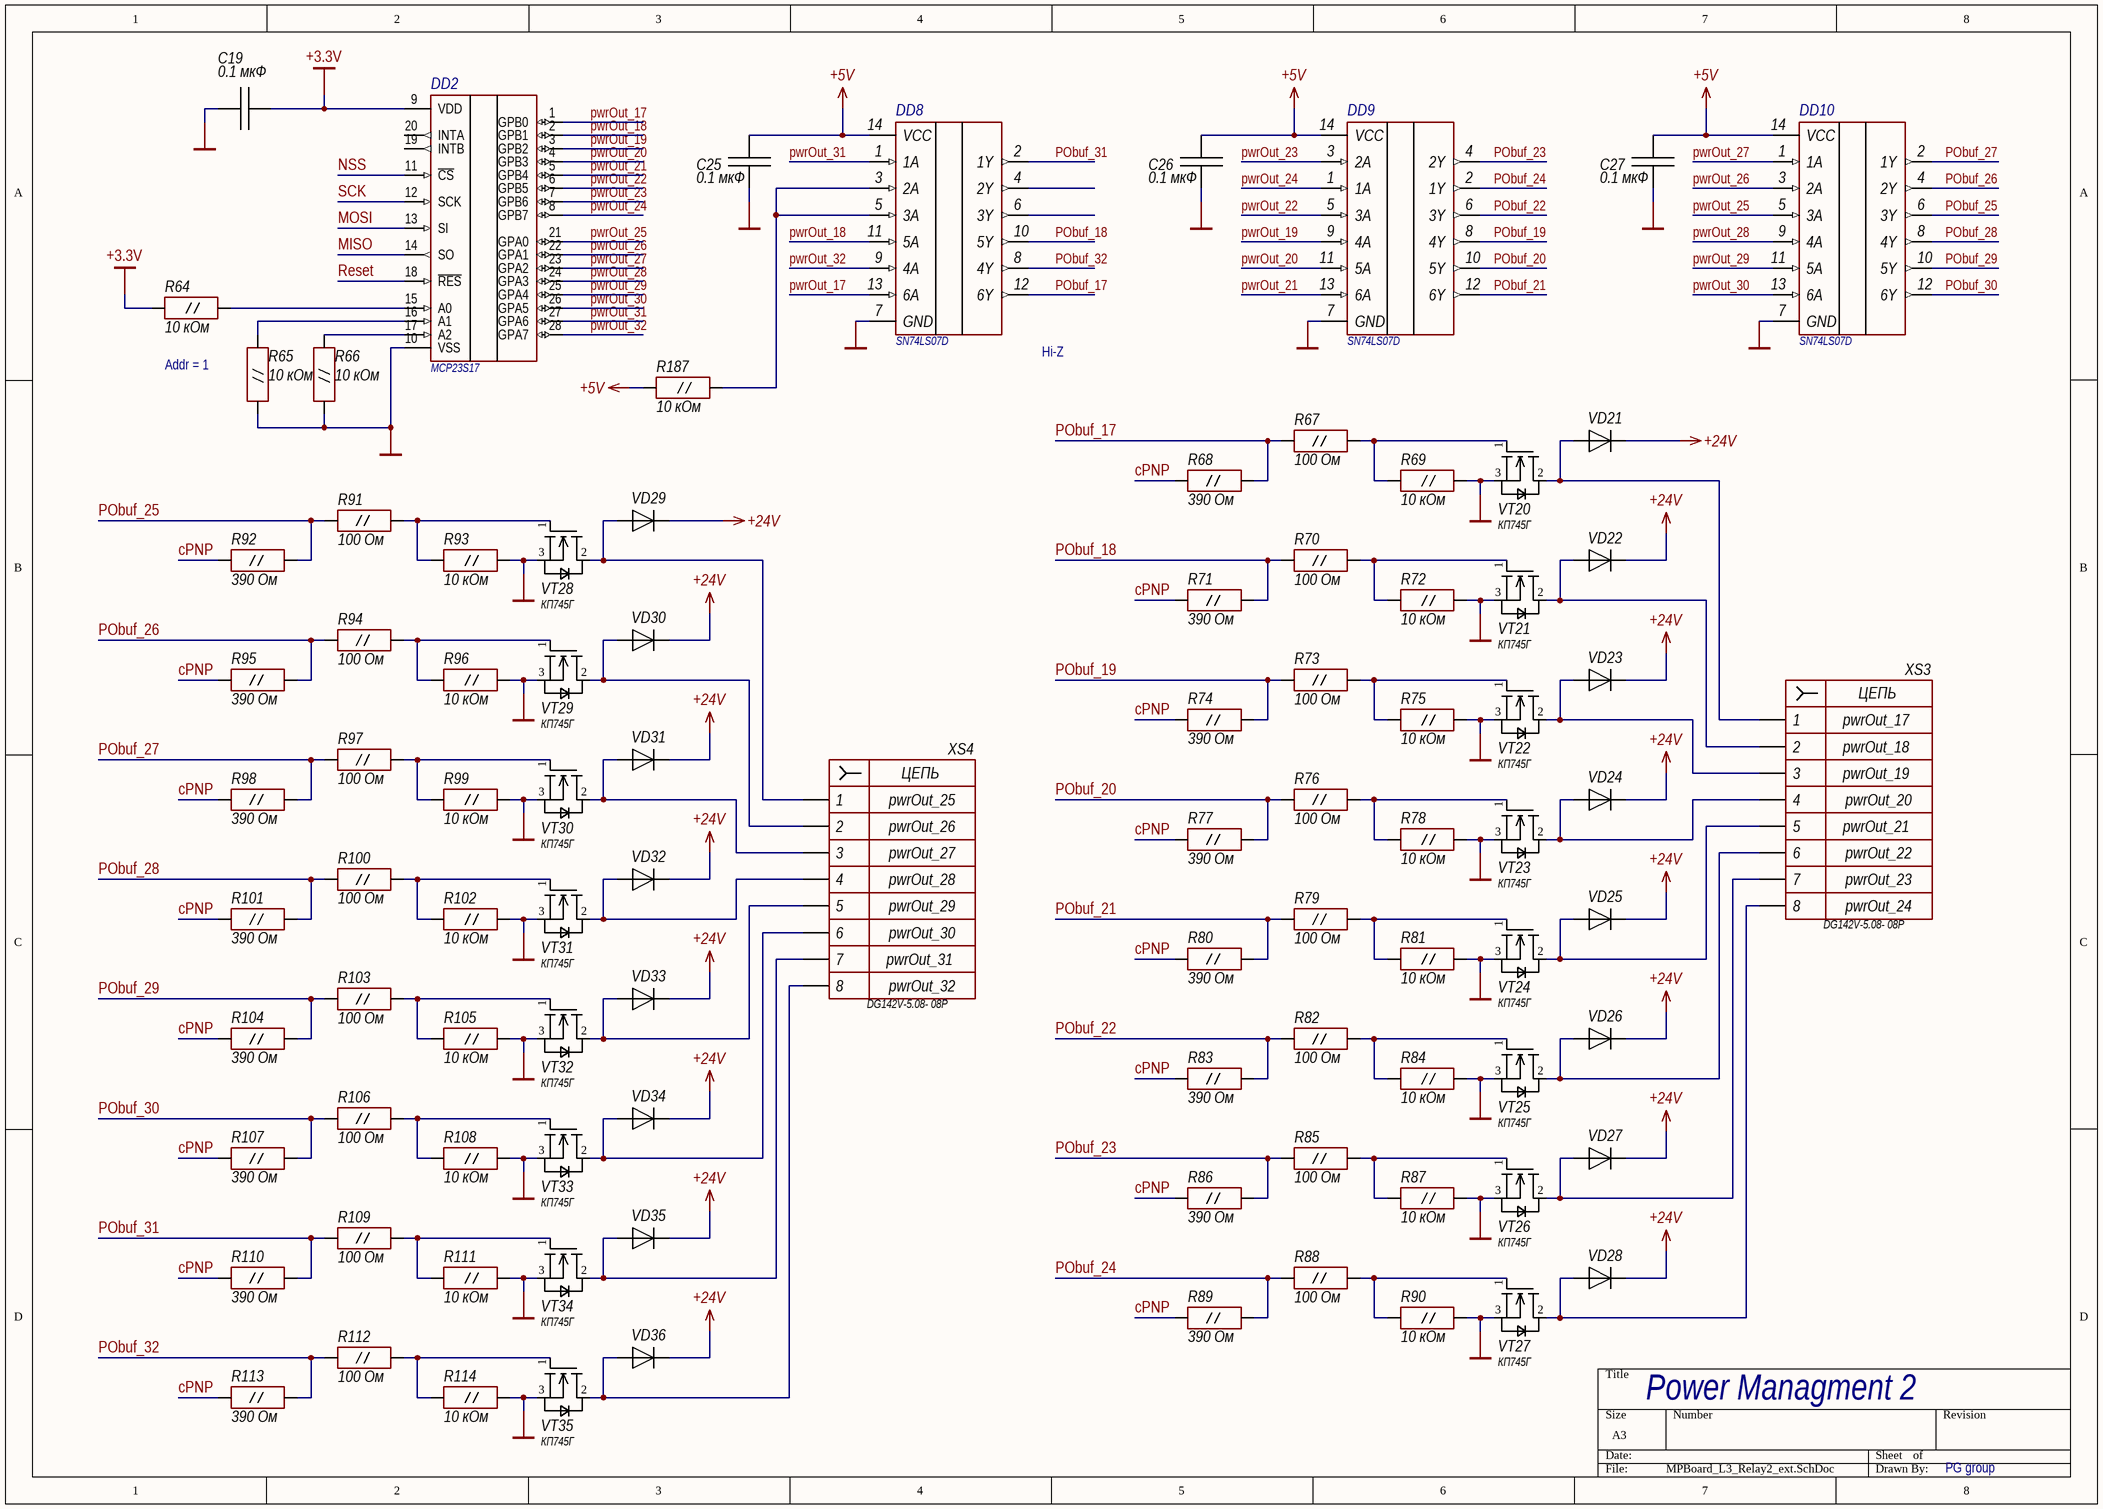
[diagram p2: MPBoard_L3_Relay2_ext.SchDoc]

### Parts
C19  0.1 мкФ  [CAP-0603]
C25  0.1 мкФ  [CAP-0603]
C26  0.1 мкФ  [CAP-0603]
C27  0.1 мкФ  [CAP-0603]
DD2  MCP23S17  [SOIC-28]
DD8  SN74LS07D  [SOIC-14]
DD9  SN74LS07D  [SOIC-14]
DD10  SN74LS07D  [SOIC-14]
R64  10 кОм  [RES-0603]
R65  10 кОм  [RES-0603]
R66  10 кОм  [RES-0603]
R67  100 Ом  [RES-0805]
R68  390 Ом  [RES-0805]
R69  10 кОм  [RES-0805]
R70  100 Ом  [RES-0805]
R71  390 Ом  [RES-0805]
R72  10 кОм  [RES-0805]
R73  100 Ом  [RES-0805]
R74  390 Ом  [RES-0805]
R75  10 кОм  [RES-0805]
R76  100 Ом  [RES-0805]
R77  390 Ом  [RES-0805]
R78  10 кОм  [RES-0805]
R79  100 Ом  [RES-0805]
R80  390 Ом  [RES-0805]
R81  10 кОм  [RES-0805]
R82  100 Ом  [RES-0805]
R83  390 Ом  [RES-0805]
R84  10 кОм  [RES-0805]
R85  100 Ом  [RES-0805]
R86  390 Ом  [RES-0805]
R87  10 кОм  [RES-0805]
R88  100 Ом  [RES-0805]
R89  390 Ом  [RES-0805]
R90  10 кОм  [RES-0805]
R91  100 Ом  [RES-0805]
R92  390 Ом  [RES-0805]
R93  10 кОм  [RES-0805]
R94  100 Ом  [RES-0805]
R95  390 Ом  [RES-0805]
R96  10 кОм  [RES-0805]
R97  100 Ом  [RES-0805]
R98  390 Ом  [RES-0805]
R99  10 кОм  [RES-0805]
R100  100 Ом  [RES-0805]
R101  390 Ом  [RES-0805]
R102  10 кОм  [RES-0805]
R103  100 Ом  [RES-0805]
R104  390 Ом  [RES-0805]
R105  10 кОм  [RES-0805]
R106  100 Ом  [RES-0805]
R107  390 Ом  [RES-0805]
R108  10 кОм  [RES-0805]
R109  100 Ом  [RES-0805]
R110  390 Ом  [RES-0805]
R111  10 кОм  [RES-0805]
R112  100 Ом  [RES-0805]
R113  390 Ом  [RES-0805]
R114  10 кОм  [RES-0805]
R187  10 кОм  [RES-0603]
VD21  HER108  [DIOD-MILS-400]  (value not drawn)
VD22  HER108  [DIOD-MILS-400]  (value not drawn)
VD23  HER108  [DIOD-MILS-400]  (value not drawn)
VD24  HER108  [DIOD-MILS-400]  (value not drawn)
VD25  HER108  [DIOD-MILS-400]  (value not drawn)
VD26  HER108  [DIOD-MILS-400]  (value not drawn)
VD27  HER108  [DIOD-MILS-400]  (value not drawn)
VD28  HER108  [DIOD-MILS-400]  (value not drawn)
VD29  HER108  [DIOD-MILS-400]  (value not drawn)
VD30  HER108  [DIOD-MILS-400]  (value not drawn)
VD31  HER108  [DIOD-MILS-400]  (value not drawn)
VD32  HER108  [DIOD-MILS-400]  (value not drawn)
VD33  HER108  [DIOD-MILS-400]  (value not drawn)
VD34  HER108  [DIOD-MILS-400]  (value not drawn)
VD35  HER108  [DIOD-MILS-400]  (value not drawn)
VD36  HER108  [DIOD-MILS-400]  (value not drawn)
VT20  КП745Г  [TO220S inline]
VT21  КП745Г  [TO220S inline]
VT22  КП745Г  [TO220S inline]
VT23  КП745Г  [TO220S inline]
VT24  КП745Г  [TO220S inline]
VT25  КП745Г  [TO220S inline]
VT26  КП745Г  [TO220S inline]
VT27  КП745Г  [TO220S inline]
VT28  КП745Г  [TO220S inline]
VT29  КП745Г  [TO220S inline]
VT30  КП745Г  [TO220S inline]
VT31  КП745Г  [TO220S inline]
VT32  КП745Г  [TO220S inline]
VT33  КП745Г  [TO220S inline]
VT34  КП745Г  [TO220S inline]
VT35  КП745Г  [TO220S inline]
XS3  DG142V-5.08- 08P  NET6: pwrOut_22  NET5: pwrOut_21  NET1: pwrOut_17  NET2: pwrOut_18  NET3: pwrOut_19  NET4: pwrOut_20  NET7: pwrOut_23  NET8: pwrOut_24  [DG142V-5.08-08]
XS4  DG142V-5.08- 08P  NET6: pwrOut_30  NET5: pwrOut_29  NET1: pwrOut_25  NET2: pwrOut_26  NET3: pwrOut_27  NET4: pwrOut_28  NET7: pwrOut_31  NET8: pwrOut_32  [DG142V-5.08-08]

### Nets
+3.3V: C19.2 DD2.9(VDD) R64.2
+5V: C25.2 C26.2 C27.2 DD8.14(VCC) DD9.14(VCC) DD10.14(VCC) R187.2
+24V: VD21.2 VD22.2 VD23.2 VD24.2 VD25.2 VD26.2 VD27.2 VD28.2 VD29.2 VD30.2 VD31.2 VD32.2 VD33.2 VD34.2 VD35.2 VD36.2
GND: C19.1 C25.1 C26.1 C27.1 DD2.10(VSS) DD8.7(GND) DD9.7(GND) DD10.7(GND) R65.1 R66.1 R69.1 R72.1 R75.1 R78.1 R81.1 R84.1 R87.1 R90.1 R93.1 R96.1 R99.1 R102.1 R105.1 R108.1 R111.1 R114.1 VT20.3(S) VT21.3(S) VT22.3(S) VT23.3(S) VT24.3(S) VT25.3(S) VT26.3(S) VT27.3(S) VT28.3(S) VT29.3(S) VT30.3(S) VT31.3(S) VT32.3(S) VT33.3(S) VT34.3(S) VT35.3(S)
cPNP: R68.1 R71.1 R74.1 R77.1 R80.1 R83.1 R86.1 R89.1 R92.1 R95.1 R98.1 R101.1 R104.1 R107.1 R110.1 R113.1
MISO: DD2.14(SO)
MOSI: DD2.13(SI)
NSS: DD2.11(~{CS})
PObuf_17: DD8.12(6Y) R67.1 R68.2
PObuf_18: DD8.10(5Y) R70.1 R71.2
PObuf_19: DD9.8(4Y) R73.1 R74.2
PObuf_20: DD9.10(5Y) R76.1 R77.2
PObuf_21: DD9.12(6Y) R79.1 R80.2
PObuf_22: DD9.6(3Y) R82.1 R83.2
PObuf_23: DD9.4(2Y) R85.1 R86.2
PObuf_24: DD9.2(1Y) R88.1 R89.2
PObuf_25: DD10.6(3Y) R91.1 R92.2
PObuf_26: DD10.4(2Y) R94.1 R95.2
PObuf_27: DD10.2(1Y) R97.1 R98.2
PObuf_28: DD10.8(4Y) R100.1 R101.2
PObuf_29: DD10.10(5Y) R103.1 R104.2
PObuf_30: DD10.12(6Y) R106.1 R107.2
PObuf_31: DD8.2(1Y) R109.1 R110.2
PObuf_32: DD8.8(4Y) R112.1 R113.2
pwrOut_17: DD2.1(GPB0) DD8.13(6A)
pwrOut_18: DD2.2(GPB1) DD8.11(5A)
pwrOut_19: DD2.3(GPB2) DD9.9(4A)
pwrOut_20: DD2.4(GPB3) DD9.11(5A)
pwrOut_21: DD2.5(GPB4) DD9.13(6A)
pwrOut_22: DD2.6(GPB5) DD9.5(3A)
pwrOut_23: DD2.7(GPB6) DD9.3(2A)
pwrOut_24: DD2.8(GPB7) DD9.1(1A)
pwrOut_25: DD2.21(GPA0) DD10.5(3A)
pwrOut_26: DD2.22(GPA1) DD10.3(2A)
pwrOut_27: DD2.23(GPA2) DD10.1(1A)
pwrOut_28: DD2.24(GPA3) DD10.9(4A)
pwrOut_29: DD2.25(GPA4) DD10.11(5A)
pwrOut_30: DD2.26(GPA5) DD10.13(6A)
pwrOut_31: DD2.27(GPA6) DD8.1(1A)
pwrOut_32: DD2.28(GPA7) DD8.9(4A)
Reset: DD2.18(~{RES})
SCK: DD2.12(SCK)
NetDD2_15: DD2.15(A0) R64.1
NetDD2_16: DD2.16(A1) R65.2
NetDD2_17: DD2.17(A2) R66.2
NetDD8_3: DD8.3(2A) DD8.5(3A) R187.1
NetR67_2: R67.2 R69.2 VT20.1(G)
NetR70_2: R70.2 R72.2 VT21.1(G)
NetR73_2: R73.2 R75.2 VT22.1(G)
NetR76_2: R76.2 R78.2 VT23.1(G)
NetR79_2: R79.2 R81.2 VT24.1(G)
NetR82_2: R82.2 R84.2 VT25.1(G)
NetR85_2: R85.2 R87.2 VT26.1(G)
NetR88_2: R88.2 R90.2 VT27.1(G)
NetR91_2: R91.2 R93.2 VT28.1(G)
NetR94_2: R94.2 R96.2 VT29.1(G)
NetR97_2: R97.2 R99.2 VT30.1(G)
NetR100_2: R100.2 R102.2 VT31.1(G)
NetR103_2: R103.2 R105.2 VT32.1(G)
NetR106_2: R106.2 R108.2 VT33.1(G)
NetR109_2: R109.2 R111.2 VT34.1(G)
NetR112_2: R112.2 R114.2 VT35.1(G)
NetVD21_1: VD21.1 VT20.2(D) XS3.1
NetVD22_1: VD22.1 VT21.2(D) XS3.2
NetVD23_1: VD23.1 VT22.2(D) XS3.3
NetVD24_1: VD24.1 VT23.2(D) XS3.4
NetVD25_1: VD25.1 VT24.2(D) XS3.5
NetVD26_1: VD26.1 VT25.2(D) XS3.6
NetVD27_1: VD27.1 VT26.2(D) XS3.7
NetVD28_1: VD28.1 VT27.2(D) XS3.8
NetVD29_1: VD29.1 VT28.2(D) XS4.1
NetVD30_1: VD30.1 VT29.2(D) XS4.2
NetVD31_1: VD31.1 VT30.2(D) XS4.3
NetVD32_1: VD32.1 VT31.2(D) XS4.4
NetVD33_1: VD33.1 VT32.2(D) XS4.5
NetVD34_1: VD34.1 VT33.2(D) XS4.6
NetVD35_1: VD35.1 VT34.2(D) XS4.7
NetVD36_1: VD36.1 VT35.2(D) XS4.8

Not connected (* = marked no-connect by the designer): DD2 19(INTB) 20(INTA); DD8 4(2Y) 6(3Y)

### Notes on the sheet
- Addr = 1
- (near DD8) Hi-Z
- Power Managment 2
- PG group
- (in symbol XS8) ЦЕПЬ

### Library data of the parts
C19 C25-C27 = C: as C18 on sheet MPBoard_L2_Relay1_ext; Package: SMD 0603; Value: 0.1 мкФ; HelpURL: https://content.kemet.com/datasheets/KEM_C1002_X7R_SMD.pdf; NameRUS: Конденсатор
DD2 = DD_MCP23S17: I/O Expander 16 SPI; MF: Microchip; MFPartNum: MCP23S17; Package: SOIC-28; HelpURL: https://www.chipdip.ru/product/mcp23s17-e-so
DD8-DD10 = DD_SN74LS07D: as DD5 on sheet MPBoard_L2_Relay1_ext; MFPartNum: SN74LS07D; Package: SOIC-14; HelpURL: https://www.chipdip.by/product/sn74ls07d
R64-R66 R187 = R_0.125W: as R13 on sheet MPBoard_L2_Relay1_ext; Package: SMD 0603; Value: 10 кОм; HelpURL: https://www.vishay.com/docs/20035/dcrcwe3.pdf; IPSPartNumber: *; NameRUS: Резистор
R67 R70 R73 R76 R79 R82 R85 R88 R91 R94 R97 R100 R103 R106 R109 R112 = R_0.125W: as R9 on sheet MPBoard_L1_PWR_ext; Package: SMD 0805; Value: 100 Ом; HelpURL: https://www.vishay.com/docs/20035/dcrcwe3.pdf; IPSPartNumber: *; NameRUS: Резистор
R68 R71 R74 R77 R80 R83 R86 R89 R92 R95 R98 R101 R104 R107 R110 R113 = R_0.125W: as R17 on sheet MPBoard_L2_Relay1_ext; Package: SMD 0805; Value: 390 Ом; HelpURL: https://www.vishay.com/docs/20035/dcrcwe3.pdf; IPSPartNumber: *; NameRUS: Резистор
R69 R72 R75 R78 R81 R84 R87 R90 R93 R96 R99 R102 R105 R108 R111 R114 = R_0.125W: as R18 on sheet MPBoard_L2_Relay1_ext; Package: SMD 0805; Value: 10 кОм; HelpURL: https://www.vishay.com/docs/20035/dcrcwe3.pdf; IPSPartNumber: *; NameRUS: Резистор
VD21-VD36 = VD: as VD5 on sheet MPBoard_L2_Relay1_ext; HelpURL: https://eu.mouser.com/ProductDetail/?qs=tHU%2FlV7kTySN6KO41tibrA%3D%3D; Value: HER108; Package: DO-204AL-2; NameRUS: Диод выпрямительный
VT20-VT35 = VT_N-MOSFET: as VT4 on sheet MPBoard_L2_Relay1_ext; MFPartNum: КП745Г; Package: TO-220; HelpURL: https://belchip.by/product/?selected_product=10167
XS3 XS4 = XS8: as XS1 on sheet MPBoard_L2_Relay1_ext; Value: DG142V-5.08- 08P; HelpURL: https://www.chipdip.by/product0/8077186472; IPSPartNumber: *

## Sheet MPBoard_L4_Sens1_ext.SchDoc
size A3; SheetNumber: 4; SheetTotal: 5
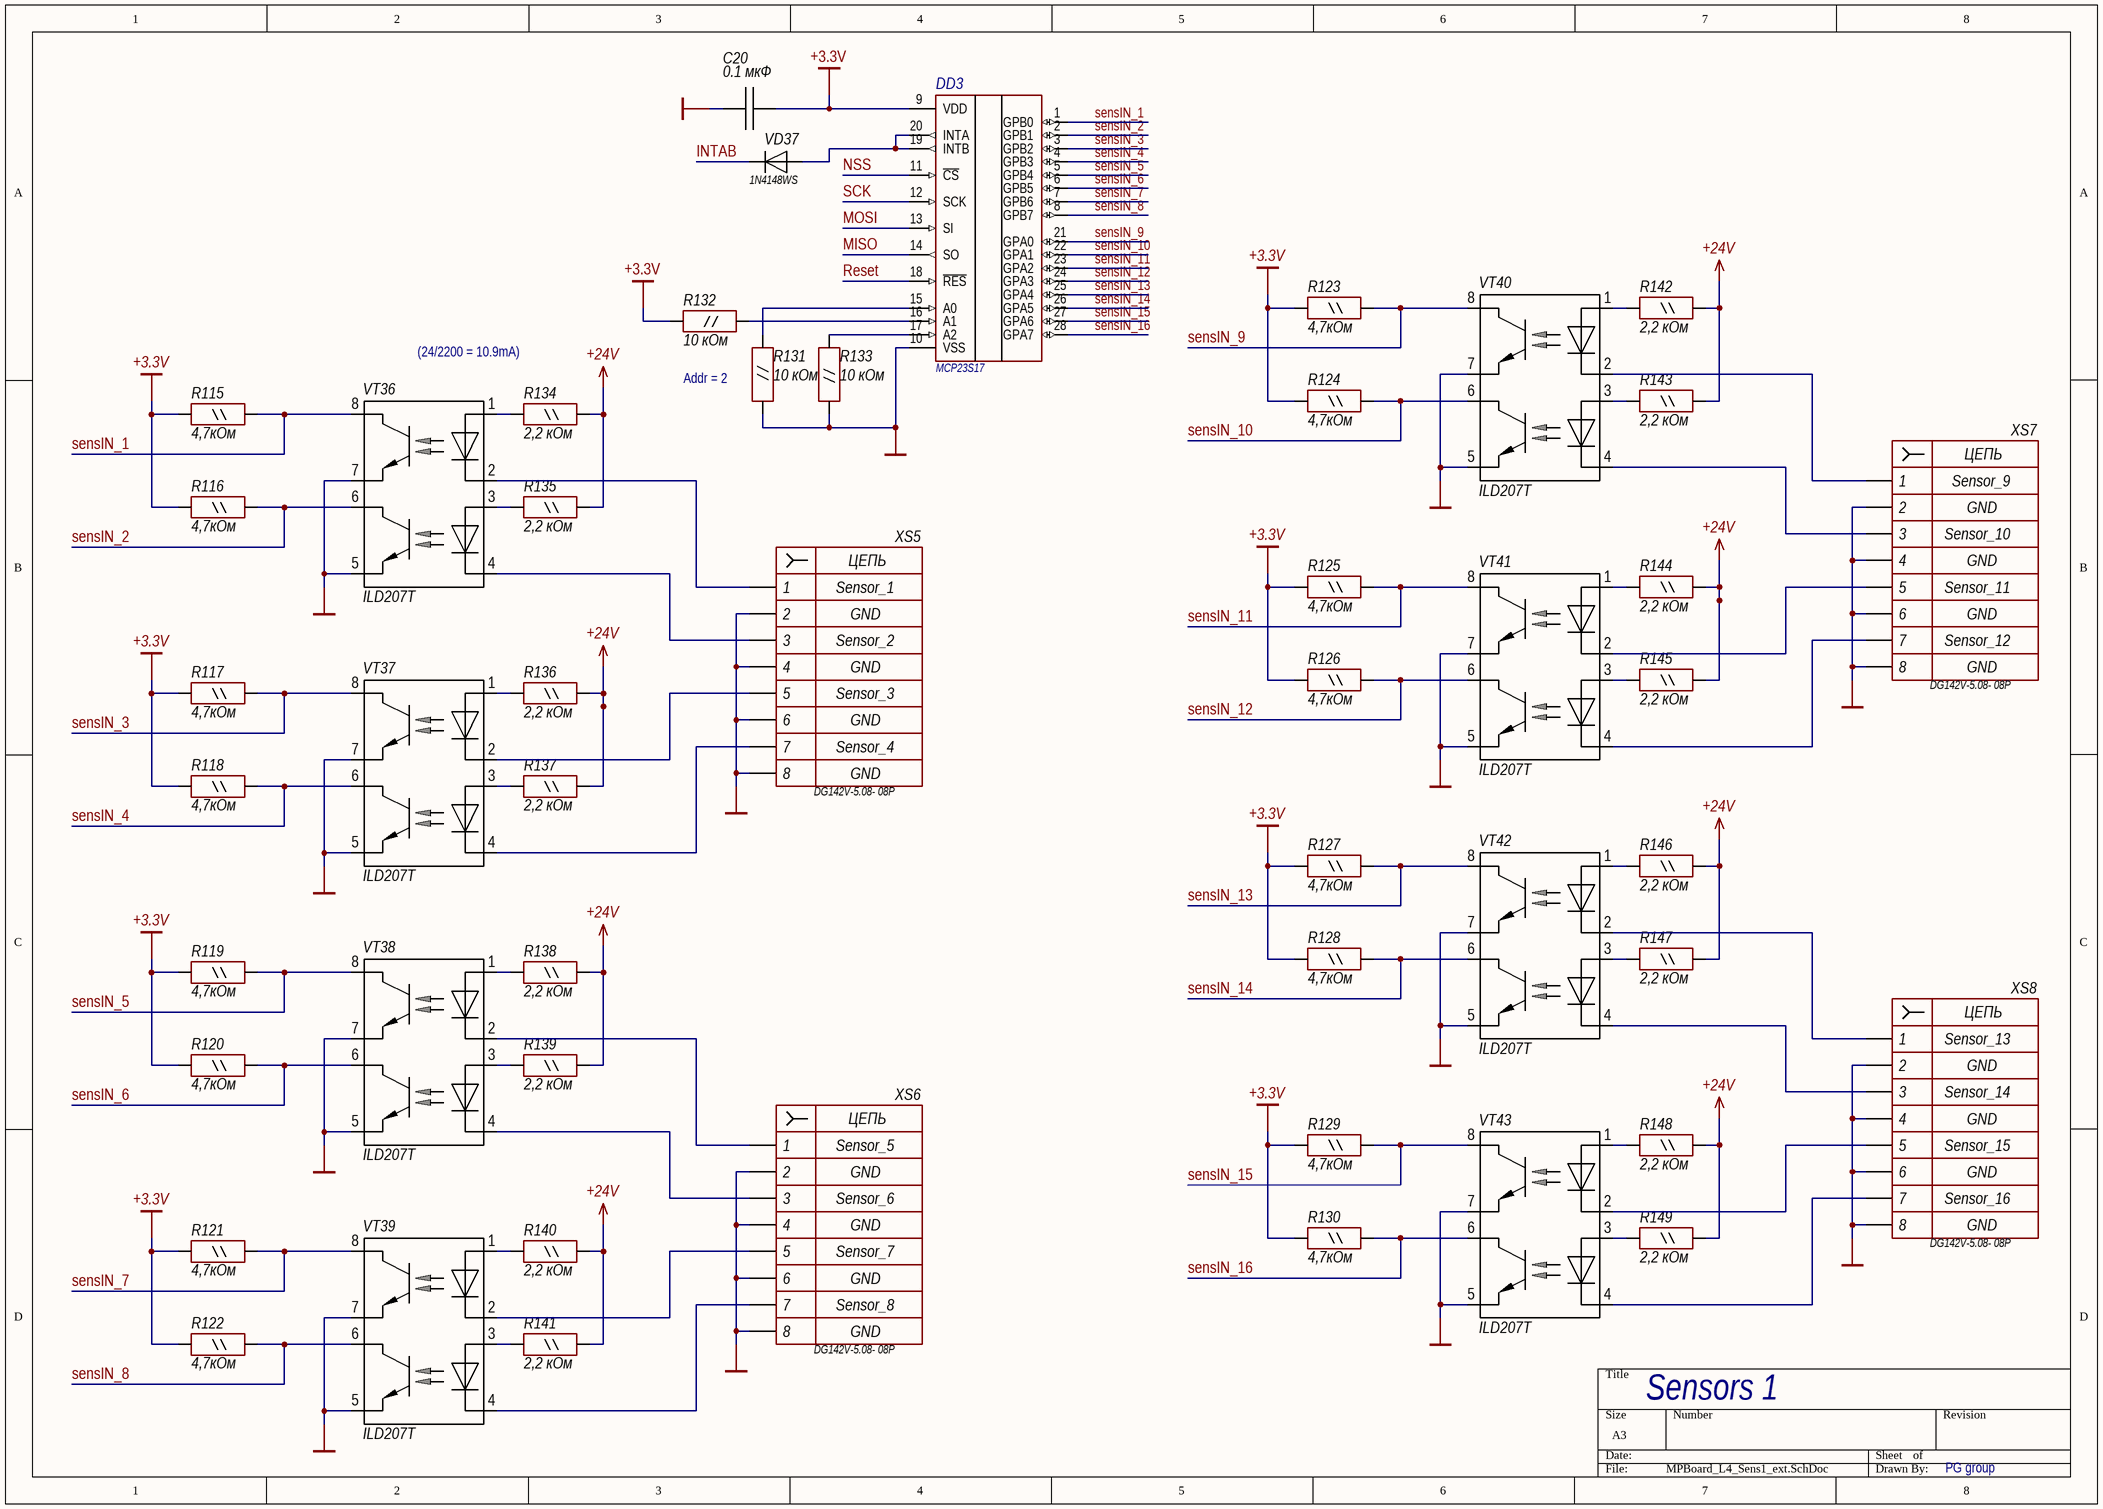
[diagram p3: MPBoard_L4_Sens1_ext.SchDoc]

### Parts
C20  0.1 мкФ  [CAP-0603]
DD3  MCP23S17  [SOIC-28]
R115  4,7кОм  [RES-0603]
R116  4,7кОм  [RES-0603]
R117  4,7кОм  [RES-0603]
R118  4,7кОм  [RES-0603]
R119  4,7кОм  [RES-0603]
R120  4,7кОм  [RES-0603]
R121  4,7кОм  [RES-0603]
R122  4,7кОм  [RES-0603]
R123  4,7кОм  [RES-0603]
R124  4,7кОм  [RES-0603]
R125  4,7кОм  [RES-0603]
R126  4,7кОм  [RES-0603]
R127  4,7кОм  [RES-0603]
R128  4,7кОм  [RES-0603]
R129  4,7кОм  [RES-0603]
R130  4,7кОм  [RES-0603]
R131  10 кОм  [RES-0603]
R132  10 кОм  [RES-0603]
R133  10 кОм  [RES-0603]
R134  2,2 кОм  [RES-0805]
R135  2,2 кОм  [RES-0805]
R136  2,2 кОм  [RES-0805]
R137  2,2 кОм  [RES-0805]
R138  2,2 кОм  [RES-0805]
R139  2,2 кОм  [RES-0805]
R140  2,2 кОм  [RES-0805]
R141  2,2 кОм  [RES-0805]
R142  2,2 кОм  [RES-0805]
R143  2,2 кОм  [RES-0805]
R144  2,2 кОм  [RES-0805]
R145  2,2 кОм  [RES-0805]
R146  2,2 кОм  [RES-0805]
R147  2,2 кОм  [RES-0805]
R148  2,2 кОм  [RES-0805]
R149  2,2 кОм  [RES-0805]
VD37  1N4148WS  [SOD-323]
VT36  ILD207T  [SOIC-8]
VT37  ILD207T  [SOIC-8]
VT38  ILD207T  [SOIC-8]
VT39  ILD207T  [SOIC-8]
VT40  ILD207T  [SOIC-8]
VT41  ILD207T  [SOIC-8]
VT42  ILD207T  [SOIC-8]
VT43  ILD207T  [SOIC-8]
XS5  DG142V-5.08- 08P  NET6: GND  NET5: Sensor_3  NET1: Sensor_1  NET3: Sensor_2  NET7: Sensor_4  [DG142V-5.08-08]
XS6  DG142V-5.08- 08P  NET6: GND  NET5: Sensor_7  NET1: Sensor_5  NET3: Sensor_6  NET7: Sensor_8  [DG142V-5.08-08]
XS7  DG142V-5.08- 08P  NET6: GND  NET5: Sensor_11  NET1: Sensor_9  NET3: Sensor_10  NET7: Sensor_12  [DG142V-5.08-08]
XS8  DG142V-5.08- 08P  NET6: GND  NET5: Sensor_15  NET1: Sensor_13  NET3: Sensor_14  NET7: Sensor_16  [DG142V-5.08-08]

### Nets
+3.3V: C20.2 DD3.9(VDD) R115.2 R116.2 R117.2 R118.2 R119.2 R120.2 R121.2 R122.2 R123.2 R124.2 R125.2 R126.2 R127.2 R128.2 R129.2 R130.2 R132.2
+24V: R134.1 R135.1 R136.1 R137.1 R138.1 R139.1 R140.1 R141.1 R142.1 R143.1 R144.1 R145.1 R146.1 R147.1 R148.1 R149.1
GND: C20.1 DD3.10(VSS) R131.2 R133.1 VT36.5 VT36.7 VT37.5 VT37.7 VT38.5 VT38.7 VT39.5 VT39.7 VT40.5 VT40.7 VT41.5 VT41.7 VT42.5 VT42.7 VT43.5 VT43.7 XS5.2 XS5.4 XS5.6 XS5.8 XS6.2 XS6.4 XS6.6 XS6.8 XS7.2 XS7.4 XS7.6 XS7.8 XS8.2 XS8.4 XS8.6 XS8.8
INTAB: VD37.2
MISO: DD3.14(SO)
MOSI: DD3.13(SI)
NSS: DD3.11(~{CS})
Reset: DD3.18(~{RES})
SCK: DD3.12(SCK)
sensIN_1: DD3.1(GPB0) R115.1 VT36.8
sensIN_2: DD3.2(GPB1) R116.1 VT36.6
sensIN_3: DD3.3(GPB2) R117.1 VT37.8
sensIN_4: DD3.4(GPB3) R118.1 VT37.6
sensIN_5: DD3.5(GPB4) R119.1 VT38.8
sensIN_6: DD3.6(GPB5) R120.1 VT38.6
sensIN_7: DD3.7(GPB6) R121.1 VT39.8
sensIN_8: DD3.8(GPB7) R122.1 VT39.6
sensIN_9: DD3.21(GPA0) R123.1 VT40.8
sensIN_10: DD3.22(GPA1) R124.1 VT40.6
sensIN_11: DD3.23(GPA2) R125.1 VT41.8
sensIN_12: DD3.24(GPA3) R126.1 VT41.6
sensIN_13: DD3.25(GPA4) R127.1 VT42.8
sensIN_14: DD3.26(GPA5) R128.1 VT42.6
sensIN_15: DD3.27(GPA6) R129.1 VT43.8
sensIN_16: DD3.28(GPA7) R130.1 VT43.6
NetDD3_15: DD3.15(A0) R131.1
NetDD3_16: DD3.16(A1) R132.1
NetDD3_17: DD3.17(A2) R133.2
NetDD3_19: DD3.19(INTB) DD3.20(INTA) VD37.1
NetR134_2: R134.2 VT36.1
NetR135_2: R135.2 VT36.3
NetR136_2: R136.2 VT37.1
NetR137_2: R137.2 VT37.3
NetR138_2: R138.2 VT38.1
NetR139_2: R139.2 VT38.3
NetR140_2: R140.2 VT39.1
NetR141_2: R141.2 VT39.3
NetR142_2: R142.2 VT40.1
NetR143_2: R143.2 VT40.3
NetR144_2: R144.2 VT41.1
NetR145_2: R145.2 VT41.3
NetR146_2: R146.2 VT42.1
NetR147_2: R147.2 VT42.3
NetR148_2: R148.2 VT43.1
NetR149_2: R149.2 VT43.3
NetVT36_2: VT36.2 XS5.1
NetVT36_4: VT36.4 XS5.3
NetVT37_2: VT37.2 XS5.5
NetVT37_4: VT37.4 XS5.7
NetVT38_2: VT38.2 XS6.1
NetVT38_4: VT38.4 XS6.3
NetVT39_2: VT39.2 XS6.5
NetVT39_4: VT39.4 XS6.7
NetVT40_2: VT40.2 XS7.1
NetVT40_4: VT40.4 XS7.3
NetVT41_2: VT41.2 XS7.5
NetVT41_4: VT41.4 XS7.7
NetVT42_2: VT42.2 XS8.1
NetVT42_4: VT42.4 XS8.3
NetVT43_2: VT43.2 XS8.5
NetVT43_4: VT43.4 XS8.7

### Notes on the sheet
- (24/2200 = 10.9mA)
- (near R131) Addr = 2
- Sensors 1
- PG group
- (in symbol XS8) ЦЕПЬ

### Library data of the parts
C20 = C: as C18 on sheet MPBoard_L2_Relay1_ext; Package: SMD 0603; Value: 0.1 мкФ; HelpURL: https://content.kemet.com/datasheets/KEM_C1002_X7R_SMD.pdf; NameRUS: Конденсатор
DD3 = DD_MCP23S17: I/O Expander 16 SPI; MF: Microchip; MFPartNum: MCP23S17; Package: SOIC-28; HelpURL: https://www.chipdip.ru/product/mcp23s17-e-so
R115-R130 = R_0.125W: Резистор 0.1 W; MFPartNum: D11/CRCW0603; MF: Vishay; Tolerance: ± 1 %; ValueDescription: Резистор 4,7кОм ± 1 % SMD 0603; Package: SMD 0603; Value: 4,7кОм; HelpURL: https://www.vishay.com/docs/20035/dcrcwe3.pdf; IPSPartNumber: *; NameRUS: Резистор
R131-R133 = R_0.125W: as R13 on sheet MPBoard_L2_Relay1_ext; Package: SMD 0603; Value: 10 кОм; HelpURL: https://www.vishay.com/docs/20035/dcrcwe3.pdf; IPSPartNumber: *; NameRUS: Резистор
R134-R149 = R_0.125W: Резистор 0.125 W; MFPartNum: CRCW080513K3FKEA; MF: Vishay; Tolerance: ± 1 %; ValueDescription: Резистор 2,2 кОм ± 1 % SMD 0805; Package: SMD 0805; Value: 2,2 кОм; HelpURL: https://www.vishay.com/docs/20035/dcrcwe3.pdf; IPSPartNumber: *; NameRUS: Резистор
VD37 = VD: Диод Выпрямительный; MF: Diotec Semiconductor; ValueDescription: Диод выпрямительный 1N4148WS SOD-323F; MFPartNum: 1N4148WS; HelpURL: https://www.chipdip.by/product/1n4148ws-4; Value: 1N4148WS; Package: SOD-323F; NameRUS: Диод выпрямительный
VT36-VT43 = VT_2xOPTOCOUPLER: Оптопара; MF: Vishay; MFPartNum: ILD207T; Package: SOIC-8; HelpURL: https://www.chipdip.by/product/ild207-t
XS5-XS8 = XS8: as XS1 on sheet MPBoard_L2_Relay1_ext; Value: DG142V-5.08- 08P; HelpURL: https://www.chipdip.by/product0/8077186472; IPSPartNumber: *; NET2: GND; NET4: GND; NET8: GND

## Sheet MPBoard_L5_Sens_2_ext.SchDoc
size A3; SheetNumber: 5; SheetTotal: 5
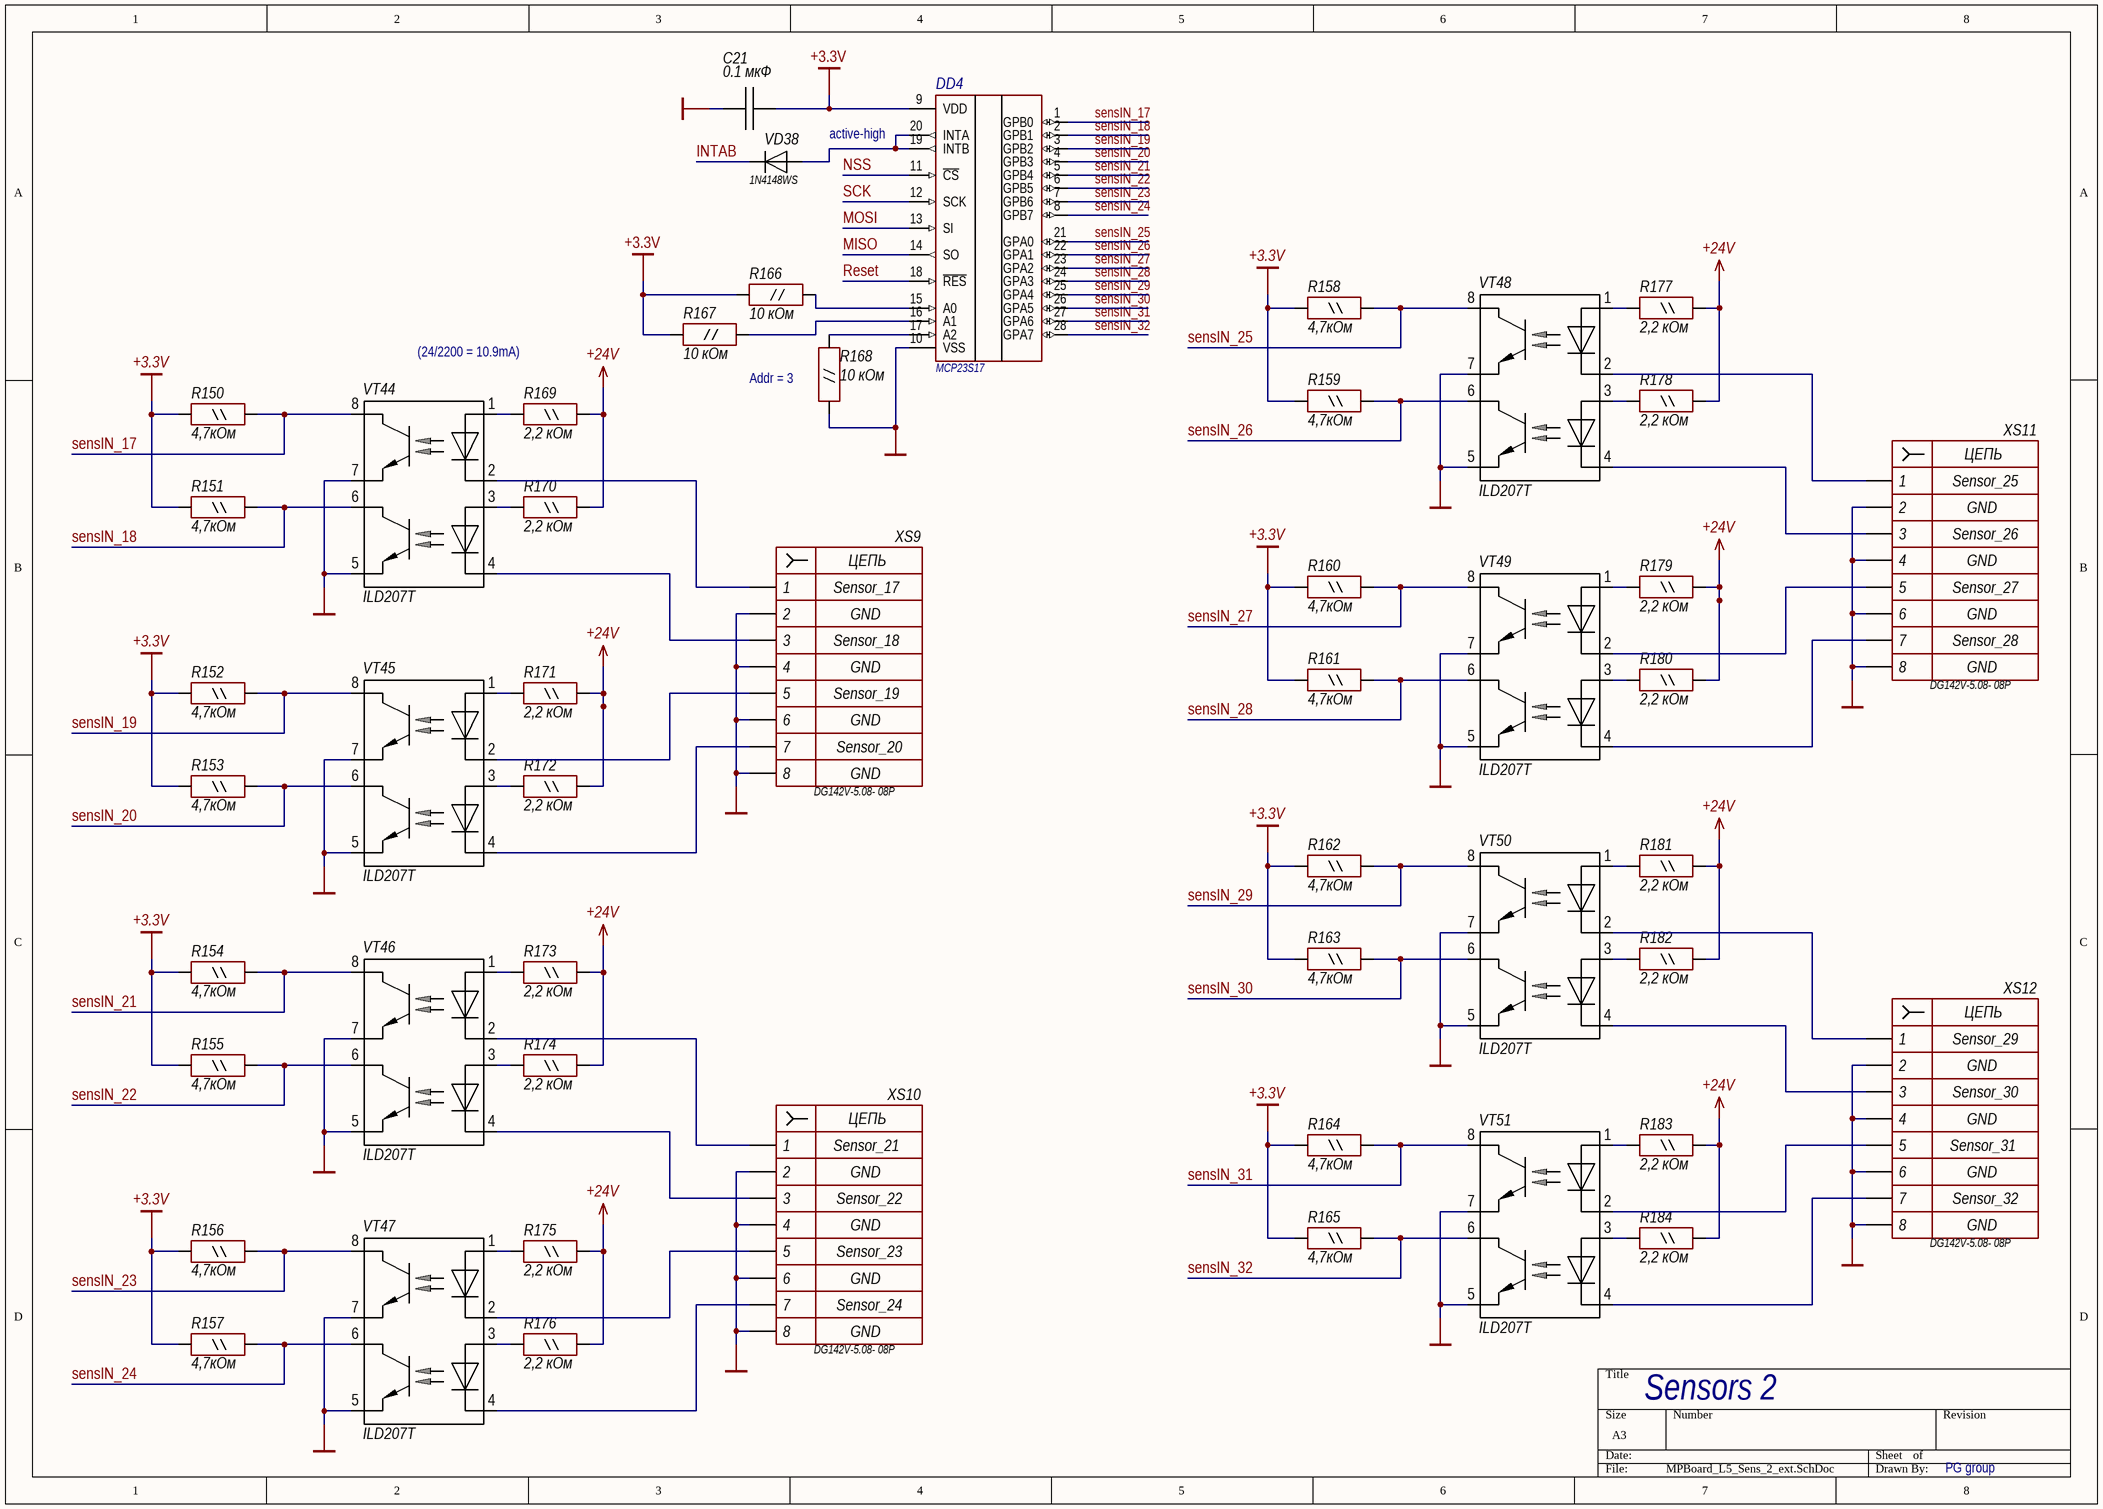
[diagram p4: MPBoard_L5_Sens_2_ext.SchDoc]

### Parts
C21  0.1 мкФ  [CAP-0603]
DD4  MCP23S17  [SOIC-28]
R150  4,7кОм  [RES-0603]
R151  4,7кОм  [RES-0603]
R152  4,7кОм  [RES-0603]
R153  4,7кОм  [RES-0603]
R154  4,7кОм  [RES-0603]
R155  4,7кОм  [RES-0603]
R156  4,7кОм  [RES-0603]
R157  4,7кОм  [RES-0603]
R158  4,7кОм  [RES-0603]
R159  4,7кОм  [RES-0603]
R160  4,7кОм  [RES-0603]
R161  4,7кОм  [RES-0603]
R162  4,7кОм  [RES-0603]
R163  4,7кОм  [RES-0603]
R164  4,7кОм  [RES-0603]
R165  4,7кОм  [RES-0603]
R166  10 кОм  [RES-0603]
R167  10 кОм  [RES-0603]
R168  10 кОм  [RES-0603]
R169  2,2 кОм  [RES-0805]
R170  2,2 кОм  [RES-0805]
R171  2,2 кОм  [RES-0805]
R172  2,2 кОм  [RES-0805]
R173  2,2 кОм  [RES-0805]
R174  2,2 кОм  [RES-0805]
R175  2,2 кОм  [RES-0805]
R176  2,2 кОм  [RES-0805]
R177  2,2 кОм  [RES-0805]
R178  2,2 кОм  [RES-0805]
R179  2,2 кОм  [RES-0805]
R180  2,2 кОм  [RES-0805]
R181  2,2 кОм  [RES-0805]
R182  2,2 кОм  [RES-0805]
R183  2,2 кОм  [RES-0805]
R184  2,2 кОм  [RES-0805]
VD38  1N4148WS  [SOD-323]
VT44  ILD207T  [SOIC-8]
VT45  ILD207T  [SOIC-8]
VT46  ILD207T  [SOIC-8]
VT47  ILD207T  [SOIC-8]
VT48  ILD207T  [SOIC-8]
VT49  ILD207T  [SOIC-8]
VT50  ILD207T  [SOIC-8]
VT51  ILD207T  [SOIC-8]
XS9  DG142V-5.08- 08P  NET6: GND  NET5: Sensor_19  NET1: Sensor_17  NET3: Sensor_18  NET7: Sensor_20  [DG142V-5.08-08]
XS10  DG142V-5.08- 08P  NET6: GND  NET5: Sensor_23  NET1: Sensor_21  NET3: Sensor_22  NET7: Sensor_24  [DG142V-5.08-08]
XS11  DG142V-5.08- 08P  NET6: GND  NET5: Sensor_27  NET1: Sensor_25  NET3: Sensor_26  NET7: Sensor_28  [DG142V-5.08-08]
XS12  DG142V-5.08- 08P  NET6: GND  NET5: Sensor_31  NET1: Sensor_29  NET3: Sensor_30  NET7: Sensor_32  [DG142V-5.08-08]

### Nets
+3.3V: C21.2 DD4.9(VDD) R150.2 R151.2 R152.2 R153.2 R154.2 R155.2 R156.2 R157.2 R158.2 R159.2 R160.2 R161.2 R162.2 R163.2 R164.2 R165.2 R166.2 R167.2
+24V: R169.1 R170.1 R171.1 R172.1 R173.1 R174.1 R175.1 R176.1 R177.1 R178.1 R179.1 R180.1 R181.1 R182.1 R183.1 R184.1
GND: C21.1 DD4.10(VSS) R168.1 VT44.5 VT44.7 VT45.5 VT45.7 VT46.5 VT46.7 VT47.5 VT47.7 VT48.5 VT48.7 VT49.5 VT49.7 VT50.5 VT50.7 VT51.5 VT51.7 XS9.2 XS9.4 XS9.6 XS9.8 XS10.2 XS10.4 XS10.6 XS10.8 XS11.2 XS11.4 XS11.6 XS11.8 XS12.2 XS12.4 XS12.6 XS12.8
INTAB: VD38.2
MISO: DD4.14(SO)
MOSI: DD4.13(SI)
NSS: DD4.11(~{CS})
Reset: DD4.18(~{RES})
SCK: DD4.12(SCK)
sensIN_17: DD4.1(GPB0) R150.1 VT44.8
sensIN_18: DD4.2(GPB1) R151.1 VT44.6
sensIN_19: DD4.3(GPB2) R152.1 VT45.8
sensIN_20: DD4.4(GPB3) R153.1 VT45.6
sensIN_21: DD4.5(GPB4) R154.1 VT46.8
sensIN_22: DD4.6(GPB5) R155.1 VT46.6
sensIN_23: DD4.7(GPB6) R156.1 VT47.8
sensIN_24: DD4.8(GPB7) R157.1 VT47.6
sensIN_25: DD4.21(GPA0) R158.1 VT48.8
sensIN_26: DD4.22(GPA1) R159.1 VT48.6
sensIN_27: DD4.23(GPA2) R160.1 VT49.8
sensIN_28: DD4.24(GPA3) R161.1 VT49.6
sensIN_29: DD4.25(GPA4) R162.1 VT50.8
sensIN_30: DD4.26(GPA5) R163.1 VT50.6
sensIN_31: DD4.27(GPA6) R164.1 VT51.8
sensIN_32: DD4.28(GPA7) R165.1 VT51.6
NetDD4_15: DD4.15(A0) R166.1
NetDD4_16: DD4.16(A1) R167.1
NetDD4_17: DD4.17(A2) R168.2
NetDD4_19: DD4.19(INTB) DD4.20(INTA) VD38.1
NetR169_2: R169.2 VT44.1
NetR170_2: R170.2 VT44.3
NetR171_2: R171.2 VT45.1
NetR172_2: R172.2 VT45.3
NetR173_2: R173.2 VT46.1
NetR174_2: R174.2 VT46.3
NetR175_2: R175.2 VT47.1
NetR176_2: R176.2 VT47.3
NetR177_2: R177.2 VT48.1
NetR178_2: R178.2 VT48.3
NetR179_2: R179.2 VT49.1
NetR180_2: R180.2 VT49.3
NetR181_2: R181.2 VT50.1
NetR182_2: R182.2 VT50.3
NetR183_2: R183.2 VT51.1
NetR184_2: R184.2 VT51.3
NetVT44_2: VT44.2 XS9.1
NetVT44_4: VT44.4 XS9.3
NetVT45_2: VT45.2 XS9.5
NetVT45_4: VT45.4 XS9.7
NetVT46_2: VT46.2 XS10.1
NetVT46_4: VT46.4 XS10.3
NetVT47_2: VT47.2 XS10.5
NetVT47_4: VT47.4 XS10.7
NetVT48_2: VT48.2 XS11.1
NetVT48_4: VT48.4 XS11.3
NetVT49_2: VT49.2 XS11.5
NetVT49_4: VT49.4 XS11.7
NetVT50_2: VT50.2 XS12.1
NetVT50_4: VT50.4 XS12.3
NetVT51_2: VT51.2 XS12.5
NetVT51_4: VT51.4 XS12.7

### Notes on the sheet
- (near DD4) active-high
- (24/2200 = 10.9mA)
- (near R168) Addr = 3
- Sensors 2
- PG group
- (in symbol XS8) ЦЕПЬ

### Library data of the parts
C21 = C: as C18 on sheet MPBoard_L2_Relay1_ext; Package: SMD 0603; Value: 0.1 мкФ; HelpURL: https://content.kemet.com/datasheets/KEM_C1002_X7R_SMD.pdf; NameRUS: Конденсатор
DD4 = DD_MCP23S17: I/O Expander 16 SPI; MF: Microchip; MFPartNum: MCP23S17; Package: SOIC-28; HelpURL: https://www.chipdip.ru/product/mcp23s17-e-so
R150-R165 = R_0.125W: as R115 on sheet MPBoard_L4_Sens1_ext; Package: SMD 0603; Value: 4,7кОм; HelpURL: https://www.vishay.com/docs/20035/dcrcwe3.pdf; IPSPartNumber: *; NameRUS: Резистор
R166-R168 = R_0.125W: as R13 on sheet MPBoard_L2_Relay1_ext; Package: SMD 0603; Value: 10 кОм; HelpURL: https://www.vishay.com/docs/20035/dcrcwe3.pdf; IPSPartNumber: *; NameRUS: Резистор
R169-R184 = R_0.125W: as R134 on sheet MPBoard_L4_Sens1_ext; Package: SMD 0805; Value: 2,2 кОм; HelpURL: https://www.vishay.com/docs/20035/dcrcwe3.pdf; IPSPartNumber: *; NameRUS: Резистор
VD38 = VD: as VD37 on sheet MPBoard_L4_Sens1_ext; MFPartNum: 1N4148WS; HelpURL: https://www.chipdip.by/product/1n4148ws-4; Value: 1N4148WS; Package: SOD-323F; NameRUS: Диод выпрямительный
VT44-VT51 = VT_2xOPTOCOUPLER: Оптопара; MF: Vishay; MFPartNum: ILD207T; Package: SOIC-8; HelpURL: https://www.chipdip.by/product/ild207-t
XS9-XS12 = XS8: as XS1 on sheet MPBoard_L2_Relay1_ext; Value: DG142V-5.08- 08P; HelpURL: https://www.chipdip.by/product0/8077186472; IPSPartNumber: *; NET2: GND; NET4: GND; NET8: GND

## Nets that join several sheets
+3.3V: MPBoard_L1_PWR_ext (J2.2 R8.1), MPBoard_L2_Relay1_ext (C18.2 DD1.9), MPBoard_L3_Relay2_ext (C19.2 DD2.9 R64.2), MPBoard_L4_Sens1_ext (19 pins), MPBoard_L5_Sens_2_ext (20 pins)
+5V: MPBoard_L1_PWR_ext (7 pins), MPBoard_L2_Relay1_ext (7 pins), MPBoard_L3_Relay2_ext (7 pins)
+24V: MPBoard_L1_PWR_ext (FU1.1 XP1.1), MPBoard_L2_Relay1_ext (16 pins), MPBoard_L3_Relay2_ext (16 pins), MPBoard_L4_Sens1_ext (16 pins), MPBoard_L5_Sens_2_ext (16 pins)
GND: MPBoard_L1_PWR_ext (29 pins), MPBoard_L2_Relay1_ext (45 pins), MPBoard_L3_Relay2_ext (42 pins), MPBoard_L4_Sens1_ext (36 pins), MPBoard_L5_Sens_2_ext (35 pins)
cPNP: MPBoard_L1_PWR_ext (VT3.3), MPBoard_L2_Relay1_ext (16 pins), MPBoard_L3_Relay2_ext (16 pins)
INTAB: MPBoard_L2_Relay1_ext (R185.2 XP3.7), MPBoard_L4_Sens1_ext (VD37.2), MPBoard_L5_Sens_2_ext (VD38.2)
MISO: MPBoard_L2_Relay1_ext (DD1.14 XP3.3), MPBoard_L3_Relay2_ext (DD2.14), MPBoard_L4_Sens1_ext (DD3.14), MPBoard_L5_Sens_2_ext (DD4.14)
MOSI: MPBoard_L2_Relay1_ext (DD1.13 XP3.4), MPBoard_L3_Relay2_ext (DD2.13), MPBoard_L4_Sens1_ext (DD3.13), MPBoard_L5_Sens_2_ext (DD4.13)
NSS: MPBoard_L2_Relay1_ext (DD1.11 XP3.5), MPBoard_L3_Relay2_ext (DD2.11), MPBoard_L4_Sens1_ext (DD3.11), MPBoard_L5_Sens_2_ext (DD4.11)
Reset: MPBoard_L2_Relay1_ext (DD1.18 XP3.6), MPBoard_L3_Relay2_ext (DD2.18), MPBoard_L4_Sens1_ext (DD3.18), MPBoard_L5_Sens_2_ext (DD4.18)
Resolution_5V: MPBoard_L1_PWR_ext (R9.1), MPBoard_L2_Relay1_ext (XP3.8)
SCK: MPBoard_L2_Relay1_ext (DD1.12 XP3.2), MPBoard_L3_Relay2_ext (DD2.12), MPBoard_L4_Sens1_ext (DD3.12), MPBoard_L5_Sens_2_ext (DD4.12)